# EAGLE design PushButton_RGB1 (EAGLE 9.6.2)

## Sheet 1 of 2
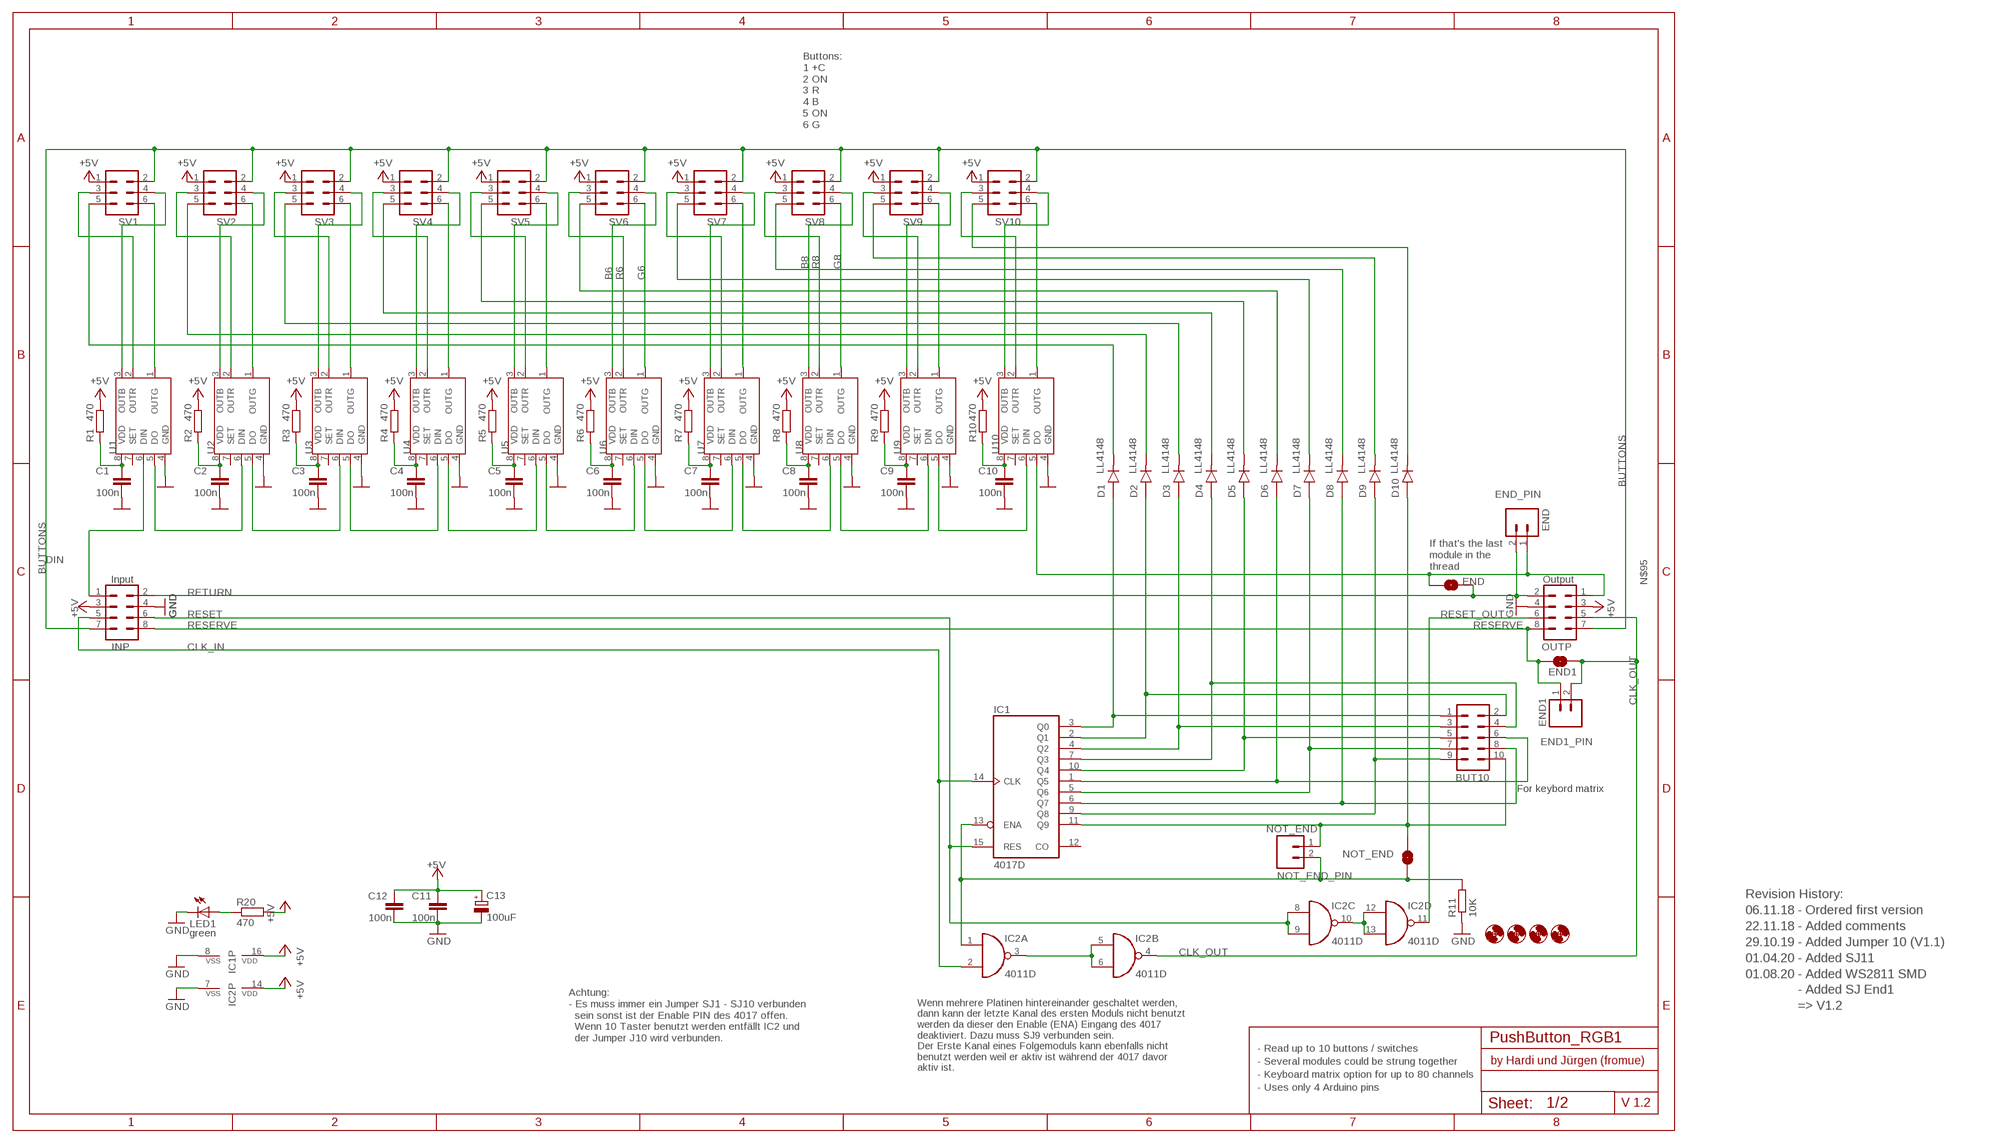
[diagram p0: schematic, sheet 1]

### Parts
BUT10  CON-HARTING-ML_ML10  [CON-HARTING-ML_ML10]
C1  100n  C-EUC0603  [C0603]
C2  100n  C-EUC0603  [C0603]
C3  100n  C-EUC0603  [C0603]
C4  100n  C-EUC0603  [C0603]
C5  100n  C-EUC0603  [C0603]
C6  100n  C-EUC0603  [C0603]
C7  100n  C-EUC0603  [C0603]
C8  100n  C-EUC0603  [C0603]
C9  100n  C-EUC0603  [C0603]
C10  100n  C-EUC0603  [C0603]
C11  100n  C-EUC0603  [C0603]
C12  100n  C-EUC0603  [C0603]
C13  100uF  CPOL-EUD/7343-31W  [D/7343-31W]
D1  LL4148  [DIO_LL4148]
D2  LL4148  [DIO_LL4148]
D3  LL4148  [DIO_LL4148]
D4  LL4148  [DIO_LL4148]
D5  LL4148  [DIO_LL4148]
D6  LL4148  [DIO_LL4148]
D7  LL4148  [DIO_LL4148]
D8  LL4148  [DIO_LL4148]
D9  LL4148  [DIO_LL4148]
D10  LL4148  [DIO_LL4148]
END  SOLDERJUMPERNO  [SJ_2S-NO]
END1  SOLDERJUMPERNO  [SJ_2S-NO]
END1_PIN  END1  M02PTH  [1X02]
END_PIN  END  M02PTH  [1X02]
H1  MOUNT-HOLE3.0  [3,0]
H2  MOUNT-HOLE3.0  [3,0]
H3  MOUNT-HOLE3.0  [3,0]
H4  MOUNT-HOLE2.8  [2,8]
IC1  4017D  [SO16]
IC2  4011D  [SO14]
INP  CON-HARTING-ML_ML08  [CON-HARTING-ML_ML08]
LED1  green  LED3MM  [LED3MM]
NOT_END  SOLDERJUMPERNO  [SJ_2S-NO]
NOT_END_PIN  NOT_END  M02PTH  [1X02]
OUTP  CON-HARTING-ML_ML08  [CON-HARTING-ML_ML08]
R1  470  R-EU_R0603  [R0603]
R2  470  R-EU_R0603  [R0603]
R3  470  R-EU_R0603  [R0603]
R4  470  R-EU_R0603  [R0603]
R5  470  R-EU_R0603  [R0603]
R6  470  R-EU_R0603  [R0603]
R7  470  R-EU_R0603  [R0603]
R8  470  R-EU_R0603  [R0603]
R9  470  R-EU_R0603  [R0603]
R10  470  R-EU_R0603  [R0603]
R11  10K  R-EU_R0603  [R0603]
R20  470  R-EU_R0603  [R0603]
SV1  CON-HARTING-ML_ML6  [CON-HARTING-ML_ML6]
SV2  CON-HARTING-ML_ML6  [CON-HARTING-ML_ML6]
SV3  CON-HARTING-ML_ML6  [CON-HARTING-ML_ML6]
SV4  CON-HARTING-ML_ML6  [CON-HARTING-ML_ML6]
SV5  CON-HARTING-ML_ML6  [CON-HARTING-ML_ML6]
SV6  CON-HARTING-ML_ML6  [CON-HARTING-ML_ML6]
SV7  CON-HARTING-ML_ML6  [CON-HARTING-ML_ML6]
SV8  CON-HARTING-ML_ML6  [CON-HARTING-ML_ML6]
SV9  CON-HARTING-ML_ML6  [CON-HARTING-ML_ML6]
SV10  CON-HARTING-ML_ML6  [CON-HARTING-ML_ML6]
U1  S3PO_MODUL_WS2811_SOUND_MP3-TF-16P_WS2811_AND_ATTINY_WS2811-ICSOP8  [SOP8]
U2  S3PO_MODUL_WS2811_SOUND_MP3-TF-16P_WS2811_AND_ATTINY_WS2811-ICSOP8  [SOP8]
U3  S3PO_MODUL_WS2811_SOUND_MP3-TF-16P_WS2811_AND_ATTINY_WS2811-ICSOP8  [SOP8]
U4  S3PO_MODUL_WS2811_SOUND_MP3-TF-16P_WS2811_AND_ATTINY_WS2811-ICSOP8  [SOP8]
U5  S3PO_MODUL_WS2811_SOUND_MP3-TF-16P_WS2811_AND_ATTINY_WS2811-ICSOP8  [SOP8]
U6  S3PO_MODUL_WS2811_SOUND_MP3-TF-16P_WS2811_AND_ATTINY_WS2811-ICSOP8  [SOP8]
U7  S3PO_MODUL_WS2811_SOUND_MP3-TF-16P_WS2811_AND_ATTINY_WS2811-ICSOP8  [SOP8]
U8  S3PO_MODUL_WS2811_SOUND_MP3-TF-16P_WS2811_AND_ATTINY_WS2811-ICSOP8  [SOP8]
U9  S3PO_MODUL_WS2811_SOUND_MP3-TF-16P_WS2811_AND_ATTINY_WS2811-ICSOP8  [SOP8]
U10  S3PO_MODUL_WS2811_SOUND_MP3-TF-16P_WS2811_AND_ATTINY_WS2811-ICSOP8  [SOP8]

### Nets
+5V: C11.1 C12.1 C13.+ IC1.16(VDD) IC2.14(P:VDD) INP.3 OUTP.3 R1.2 R2.2 R3.2 R4.2 R5.2 R6.2 R7.2 R8.2 R9.2 R10.2 R20.2 SV1.1 SV2.1 SV3.1 SV4.1 SV5.1 SV6.1 SV7.1 SV8.1 SV9.1 SV10.1 ; also sheet 2
B6: SV6.4 U6.3(OUTB)
B8: SV8.4 U8.3(OUTB)
BUTTONS: INP.7 OUTP.7 SV1.2 SV2.2 SV3.2 SV4.2 SV5.2 SV6.2 SV7.2 SV8.2 SV9.2 SV10.2 ; also sheet 2
CLK_IN: IC1.14(CLK) IC2.2(A:I1) INP.5
CLK_OUT: END1.1 END1_PIN.2 IC2.4(B:O) OUTP.5
DIN: INP.1 U1.6(DIN)
G6: SV6.6 U6.1(OUTG)
G8: SV8.6 U8.1(OUTG)
GND: C1.2 C2.2 C3.2 C4.2 C5.2 C6.2 C7.2 C8.2 C9.2 C10.2 C11.2 C12.2 C13.- IC1.8(VSS) IC2.7(P:VSS) INP.4 LED1.K(C) OUTP.4 R11.1 U1.4(GND) U2.4(GND) U3.4(GND) U4.4(GND) U5.4(GND) U6.4(GND) U7.4(GND) U8.4(GND) U9.4(GND) U10.4(GND)
N$1: IC2.3(A:O) IC2.5(B:I0) IC2.6(B:I1)
N$2: IC1.13(ENA) IC2.1(A:I0) NOT_END.1 NOT_END_PIN.2 R11.2
N$3: IC2.10(C:O) IC2.12(D:I0) IC2.13(D:I1)
N$5: BUT10.10 D10.A IC1.11(Q9) NOT_END.2 NOT_END_PIN.1
N$6: C3.1 R3.1 U3.8(VDD)
N$7: C6.1 R6.1 U6.8(VDD)
N$8: U3.5(DO) U4.6(DIN)
N$9: C4.1 R4.1 U4.8(VDD)
N$10: D9.C SV9.5
N$11: BUT10.2 D2.A IC1.2(Q1)
N$12: BUT10.3 D3.A IC1.4(Q2)
N$13: BUT10.4 D4.A IC1.7(Q3)
N$14: BUT10.5 D5.A IC1.10(Q4)
N$15: BUT10.6 D6.A IC1.1(Q5)
N$16: BUT10.7 D7.A IC1.5(Q6)
N$17: BUT10.8 D8.A IC1.6(Q7)
N$18: BUT10.9 D9.A IC1.9(Q8)
N$19: SV1.3 U1.2(OUTR)
N$20: U4.5(DO) U5.6(DIN)
N$21: LED1.A R20.1
N$22: U1.5(DO) U2.6(DIN)
N$23: C5.1 R5.1 U5.8(VDD)
N$25: D10.C SV10.5
N$26: SV1.4 U1.3(OUTB)
N$27: SV1.6 U1.1(OUTG)
N$35: BUT10.1 D1.A IC1.3(Q0)
N$46: SV2.4 U2.3(OUTB)
N$49: SV2.6 U2.1(OUTG)
N$51: SV2.3 U2.2(OUTR)
N$56: SV3.4 U3.3(OUTB)
N$57: SV3.6 U3.1(OUTG)
N$58: SV3.3 U3.2(OUTR)
N$76: C1.1 R1.1 U1.8(VDD)
N$77: C2.1 R2.1 U2.8(VDD)
N$78: U6.5(DO) U7.6(DIN)
N$81: U2.5(DO) U3.6(DIN)
N$82: U5.5(DO) U6.6(DIN)
N$83: C7.1 R7.1 U7.8(VDD)
N$85: U7.5(DO) U8.6(DIN)
N$86: C8.1 R8.1 U8.8(VDD)
N$87: SV4.4 U4.3(OUTB)
N$88: SV4.6 U4.1(OUTG)
N$89: U8.5(DO) U9.6(DIN)
N$90: C9.1 R9.1 U9.8(VDD)
N$91: SV4.3 U4.2(OUTR)
N$92: U9.5(DO) U10.6(DIN)
N$93: C10.1 R10.1 U10.8(VDD)
N$95: END.2 END_PIN.1 OUTP.1 U10.5(DO)
N$96: SV5.4 U5.3(OUTB)
N$97: SV5.6 U5.1(OUTG)
N$98: SV5.3 U5.2(OUTR)
N$104: SV7.4 U7.3(OUTB)
N$105: SV7.6 U7.1(OUTG)
N$106: SV7.3 U7.2(OUTR)
N$112: SV9.4 U9.3(OUTB)
N$113: SV9.6 U9.1(OUTG)
N$114: SV9.3 U9.2(OUTR)
N$116: SV10.4 U10.3(OUTB)
N$117: SV10.6 U10.1(OUTG)
N$118: SV10.3 U10.2(OUTR)
N$120: D1.C SV1.5
N$121: D2.C SV2.5
N$122: D3.C SV3.5
N$123: D4.C SV4.5
N$124: D5.C SV5.5
N$125: D6.C SV6.5
N$126: D7.C SV7.5
N$127: D8.C SV8.5
R6: SV6.3 U6.2(OUTR)
R8: SV8.3 U8.2(OUTR)
RESERVE: END1.2 END1_PIN.1 INP.8 OUTP.8
RESET: IC1.15(RES) IC2.8(C:I0) IC2.9(C:I1) INP.6
RESET_OUT: IC2.11(D:O) OUTP.6
RETURN: END.1 END_PIN.2 INP.2 OUTP.2
Unconnected: IC1.12(CO) U1.7(SET) U2.7(SET) U3.7(SET) U4.7(SET) U5.7(SET) U6.7(SET) U7.7(SET) U8.7(SET) U9.7(SET) U10.7(SET)

### Notes on the sheet
- Buttons:
  1 +C
  2 ON
  3 R
  4 B
  5 ON
  6 G
- If that's the last
  module in the
  thread
- Input | Output
- For keybord matrix
- Achtung:
  - Es muss immer ein Jumper SJ1 - SJ10 verbunden
    sein sonst ist der Enable PIN des 4017 offen.
    Wenn 10 Taster benutzt werden entfällt IC2 und 
    der Jumper J10 wird verbunden.
- Wenn mehrere Platinen hintereinander geschaltet werden,
  dann kann der letzte Kanal des ersten Moduls nicht benutzt
  werden da dieser den Enable (ENA) Eingang des 4017
  deaktiviert. Dazu muss SJ9 verbunden sein.
  Der Erste Kanal eines Folgemoduls kann ebenfalls nicht
  benutzt werden weil er aktiv ist während der 4017 davor
  aktiv ist.
- Revision History:
  06.11.18 - Ordered first version
  22.11.18 - Added comments
  29.10.19 - Added Jumper 10 (V1.1)
  01.04.20 - Added SJ11
  01.08.20 - Added WS2811 SMD
                 - Added SJ End1
                 => V1.2
- by Hardi und Jürgen (fromue)
- - Read up to 10 buttons / switches
  - Several modules could be strung together
  - Keyboard matrix option for up to 80 channels
  - Uses only 4 Arduino pins
- V 1.2

## Sheet 2 of 2
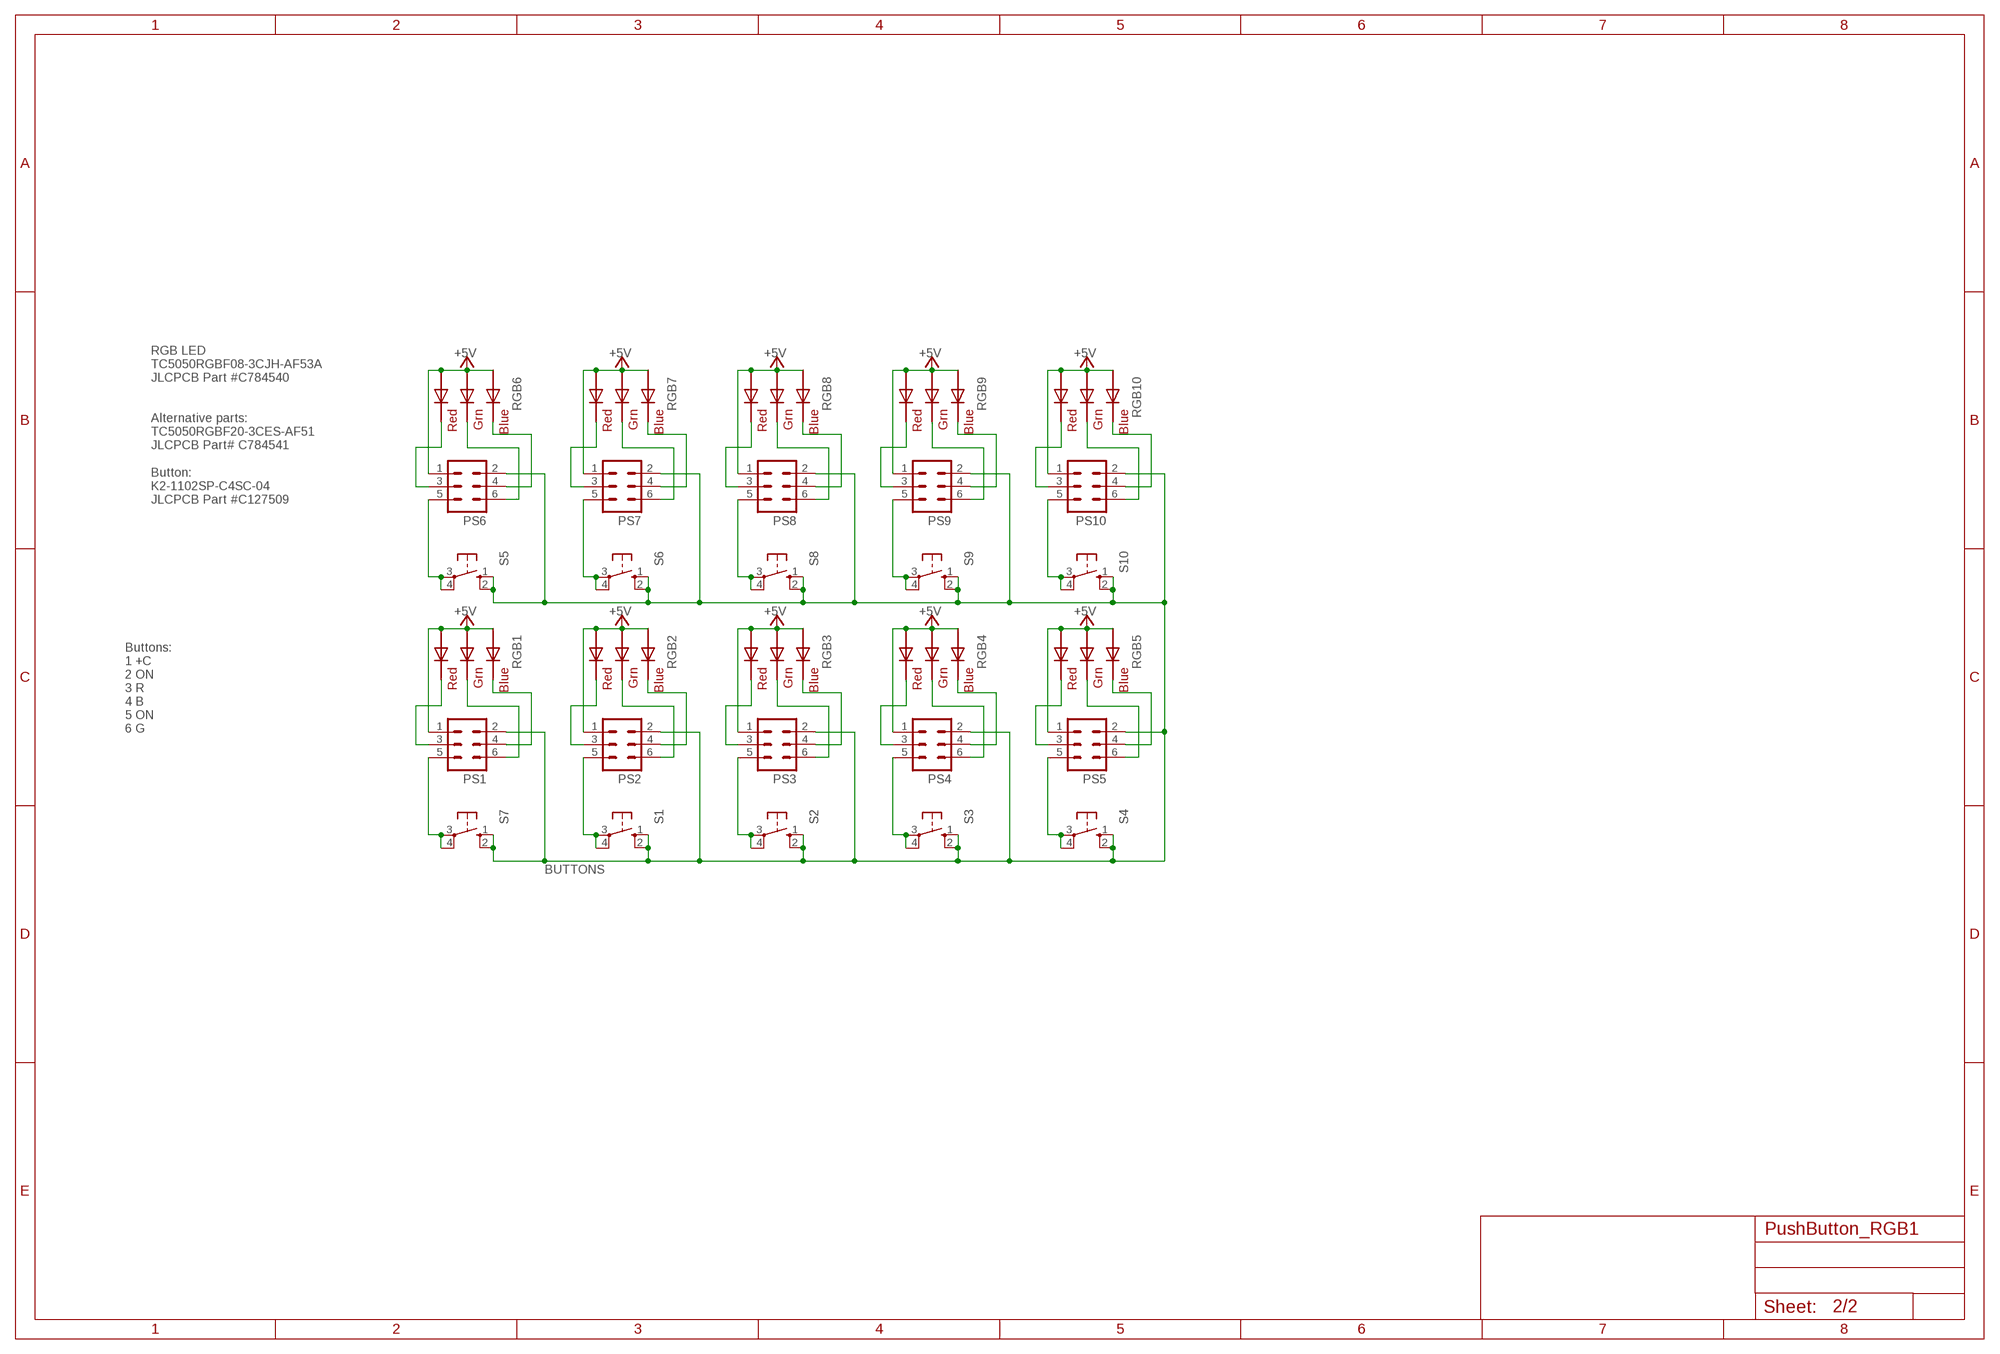
[diagram p1: schematic, sheet 2]

### Parts
PS1  CON-HARTING-ML_ML6BKL10120958  [BKL10120958_MIRROR]
PS2  CON-HARTING-ML_ML6BKL10120958  [BKL10120958_MIRROR]
PS3  CON-HARTING-ML_ML6BKL10120958  [BKL10120958_MIRROR]
PS4  CON-HARTING-ML_ML6BKL10120958  [BKL10120958_MIRROR]
PS5  CON-HARTING-ML_ML6BKL10120958  [BKL10120958_MIRROR]
PS6  CON-HARTING-ML_ML6BKL10120958  [BKL10120958_MIRROR]
PS7  CON-HARTING-ML_ML6BKL10120958  [BKL10120958_MIRROR]
PS8  CON-HARTING-ML_ML6BKL10120958  [BKL10120958_MIRROR]
PS9  CON-HARTING-ML_ML6BKL10120958  [BKL10120958_MIRROR]
PS10  CON-HARTING-ML_ML6BKL10120958  [BKL10120958_MIRROR]
RGB1  RGBLED5050  [RGBLED5050]
RGB2  RGBLED5050  [RGBLED5050]
RGB3  RGBLED5050  [RGBLED5050]
RGB4  RGBLED5050  [RGBLED5050]
RGB5  RGBLED5050  [RGBLED5050]
RGB6  RGBLED5050  [RGBLED5050]
RGB7  RGBLED5050  [RGBLED5050]
RGB8  RGBLED5050  [RGBLED5050]
RGB9  RGBLED5050  [RGBLED5050]
RGB10  RGBLED5050  [RGBLED5050]
S1  10-XXB3F-10XX_SMD  [B3F-10XX_SMD]
S2  10-XXB3F-10XX_SMD  [B3F-10XX_SMD]
S3  10-XXB3F-10XX_SMD  [B3F-10XX_SMD]
S4  10-XXB3F-10XX_SMD  [B3F-10XX_SMD]
S5  10-XXB3F-10XX_SMD  [B3F-10XX_SMD]
S6  10-XXB3F-10XX_SMD  [B3F-10XX_SMD]
S7  10-XXB3F-10XX_SMD  [B3F-10XX_SMD]
S8  10-XXB3F-10XX_SMD  [B3F-10XX_SMD]
S9  10-XXB3F-10XX_SMD  [B3F-10XX_SMD]
S10  10-XXB3F-10XX_SMD  [B3F-10XX_SMD]

### Nets
+5V: PS1.1 PS2.1 PS3.1 PS4.1 PS5.1 PS6.1 PS7.1 PS8.1 PS9.1 PS10.1 RGB1.1(GREEN_A) RGB1.2(RED_A) RGB1.3(BLUE_A) RGB2.1(GREEN_A) RGB2.2(RED_A) RGB2.3(BLUE_A) RGB3.1(GREEN_A) RGB3.2(RED_A) RGB3.3(BLUE_A) RGB4.1(GREEN_A) RGB4.2(RED_A) RGB4.3(BLUE_A) RGB5.1(GREEN_A) RGB5.2(RED_A) RGB5.3(BLUE_A) RGB6.1(GREEN_A) RGB6.2(RED_A) RGB6.3(BLUE_A) RGB7.1(GREEN_A) RGB7.2(RED_A) RGB7.3(BLUE_A) RGB8.1(GREEN_A) RGB8.2(RED_A) RGB8.3(BLUE_A) RGB9.1(GREEN_A) RGB9.2(RED_A) RGB9.3(BLUE_A) RGB10.1(GREEN_A) RGB10.2(RED_A) RGB10.3(BLUE_A) ; also sheet 1
B_6: PS6.4 RGB6.4(BLUE_C)
B_8: PS8.4 RGB8.4(BLUE_C)
BUTTONS: PS1.2 PS2.2 PS3.2 PS4.2 PS5.2 PS6.2 PS7.2 PS8.2 PS9.2 PS10.2 S1.1(S) S1.2(S1) S2.1(S) S2.2(S1) S3.1(S) S3.2(S1) S4.1(S) S4.2(S1) S5.1(S) S5.2(S1) S6.1(S) S6.2(S1) S7.1(S) S7.2(S1) S8.1(S) S8.2(S1) S9.1(S) S9.2(S1) S10.1(S) S10.2(S1) ; also sheet 1
G_6: PS6.6 RGB6.6(GREEN_C)
G_8: PS8.6 RGB8.6(GREEN_C)
N$4: PS1.6 RGB1.6(GREEN_C)
N$24: PS1.4 RGB1.4(BLUE_C)
N$28: PS1.3 RGB1.5(RED_C)
N$30: PS1.5 S7.3(P) S7.4(P1)
N$32: PS2.6 RGB2.6(GREEN_C)
N$33: PS2.4 RGB2.4(BLUE_C)
N$34: PS2.3 RGB2.5(RED_C)
N$37: PS2.5 S1.3(P) S1.4(P1)
N$39: PS3.6 RGB3.6(GREEN_C)
N$40: PS3.4 RGB3.4(BLUE_C)
N$41: PS3.3 RGB3.5(RED_C)
N$43: PS3.5 S2.3(P) S2.4(P1)
N$45: PS4.6 RGB4.6(GREEN_C)
N$47: PS4.4 RGB4.4(BLUE_C)
N$48: PS4.3 RGB4.5(RED_C)
N$52: PS4.5 S3.3(P) S3.4(P1)
N$54: PS5.6 RGB5.6(GREEN_C)
N$55: PS5.4 RGB5.4(BLUE_C)
N$59: PS5.3 RGB5.5(RED_C)
N$61: PS5.5 S4.3(P) S4.4(P1)
N$67: PS6.5 S5.3(P) S5.4(P1)
N$69: PS7.6 RGB7.6(GREEN_C)
N$70: PS7.4 RGB7.4(BLUE_C)
N$71: PS7.3 RGB7.5(RED_C)
N$73: PS7.5 S6.3(P) S6.4(P1)
N$94: PS8.5 S8.3(P) S8.4(P1)
N$103: PS9.6 RGB9.6(GREEN_C)
N$107: PS9.4 RGB9.4(BLUE_C)
N$111: PS9.3 RGB9.5(RED_C)
N$119: PS9.5 S9.3(P) S9.4(P1)
N$129: PS10.6 RGB10.6(GREEN_C)
N$130: PS10.4 RGB10.4(BLUE_C)
N$131: PS10.3 RGB10.5(RED_C)
N$133: PS10.5 S10.3(P) S10.4(P1)
R_6: PS6.3 RGB6.5(RED_C)
R_8: PS8.3 RGB8.5(RED_C)

### Notes on the sheet
- RGB LED
  TC5050RGBF08-3CJH-AF53A
  JLCPCB Part #C784540
  
  
  Alternative parts: 
  TC5050RGBF20-3CES-AF51
  JLCPCB Part# C784541
  
  Button:
  K2-1102SP-C4SC-04
  JLCPCB Part #C127509
- Buttons:
  1 +C
  2 ON
  3 R
  4 B
  5 ON
  6 G

## Library data of the parts
BUT10 = PushButtonAction_4017_2:CON-HARTING-ML_ML10: HARTING; OC_FARNELL: unknown; OC_NEWARK: unknown
C1-C12 = rcl:C-EU: CAPACITOR, European symbol; SPICEPREFIX: C
C13 = rcl:CPOL-EU: POLARIZED CAPACITOR, European symbol; SPICEPREFIX: C
D1-D10 = LL4148:LL4148: Surface Mount Switching Glass Check availability <https://pricing.snapeda.com/parts/LL4148/ON/view-part?ref=eda>; AVAILABILITY: In Stock; DESCRIPTION: Diode Standard 75V 300mA (DC) Surface Mount Mini MELF/DL-35; MF: ON; MP: LL4148; PACKAGE: SOD-80 Fairchild Semiconductor; PRICE: None
END END1 NOT_END = SparkFun-Retired:SOLDERJUMPER: Solder Jumper Standard SMD solder jumper. Used to automate production. Two varients : Normally Open and Normally Closed are the same, but have different paste layers. NC will have a large amount of paste and should jumper during reflow.
END1_PIN END_PIN NOT_END_PIN = SparkFun-Connectors:M02: Standard 2-pin 0.1" header. Use with - straight break away headers ( PRT-00116) - right angle break away headers (PRT-00553) - swiss pins (PRT-00743) - machine pins (PRT-00117) - female headers (PRT-00115) Molex polarized connector foot print use with: PRT-08233 with associated crimp pins and housings. 2.54_SCREWTERM for use with PRT-10571. 3.5mm Screw Terminal footprints for PRT-08084 5mm Screw Terminal footprints for use with PRT-08432
H1-H4 = holes:MOUNT-HOLE: MOUNTING HOLE with drill center marker
IC1 = 40xx:4017: COUNTER/DIVIDER
IC2 = 40xx:4011: Quad 2-input NAND; SPICEPREFIX: J
INP OUTP = PushButtonAction_4017_2:CON-HARTING-ML_ML08: Modified by Hardi; OC_FARNELL: unknown; OC_NEWARK: unknown
LED1 = led:LED: LED OSRAM: - CHIPLED LG R971, LG N971, LY N971, LG Q971, LY Q971, LO R971, LY R971 LH N974, LH R974 LS Q976, LO Q976, LY Q976 LO Q996 - Hyper CHIPLED LW Q18S LB Q993, LB Q99A, LB R99A - SideLED LS A670, LO A670, LY A670, LG A670, LP A670 LB A673, LV A673, LT A673, LW A673 LH A674 LY A675 LS A676, LA A676, LO A676, LY A676, LW A676 LS A679, LY A679, LG A679 - Hyper Micro SIDELED® LS Y876, LA Y876, LO Y876, LY Y876 LT Y87S - SmartLED LW L88C, LW L88S LB L89C, LB L89S, LG L890 LS L89K, LO L89K, LY L89K LS L896, LA L896, LO L896, LY L896 - TOPLED LS T670, LO T670, LY T670, LG T670, LP T670 LSG T670, LSP T670, LSY T670, LOP T670, LYG T670 LG T671, LOG T671, LSG T671 LB T673, LV T673, LT T673, LW T673 LH T674 LS T676, LA T676, LO T676, LY T676, LB T676, LH T676, LSB T676, LW T676 LB T67C, LV T67C, LT T67C, LS T67K, LO T67K, LY T67K, LW E67C LS E67B, LA E67B, LO E67B, LY E67B, LB E67C, LV E67C, LT E67C LW T67C LS T679, LY T679, LG T679 LS T770, LO T770, LY T770, LG T770, LP T770 LB T773, LV T773, LT T773, LW T773 LH T774 LS E675, LA E675, LY E675, LS T675 LS T776, LA T776, LO T776, LY T776, LB T776 LHGB T686 LT T68C, LB T68C - Hyper Mini TOPLED® LB M676 - Mini TOPLED Santana® LG M470 LS M47K, LO M47K, LY M47K Source: http://www.osram.convergy.de LUXEON: - LUMILED® LXK2-PW12-R00, LXK2-PW12-S00, LXK2-PW14-U00, LXK2-PW14-V00 LXK2-PM12-R00, LXK2-PM12-S00, LXK2-PM14-U00 LXK2-PE12-Q00, LXK2-PE12-R00, LXK2-PE12-S00, LXK2-PE14-T00, LXK2-PE14-U00 LXK2-PB12-K00, LXK2-PB12-L00, LXK2-PB12-M00, LXK2-PB14-N00, LXK2-PB14-P00, LXK2-PB14-Q00 LXK2-PR12-L00, LXK2-PR12-M00, LXK2-PR14-Q00, LXK2-PR14-R00 LXK2-PD12-Q00, LXK2-PD12-R00, LXK2-PD12-S00 LXK2-PH12-R00, LXK2-PH12-S00 LXK2-PL12-P00, LXK2-PL12-Q00, LXK2-PL12-R00 Source: www.luxeon.com KINGBRIGHT: KA-3528ASYC Source: www.kingbright.com
PS1-PS10 = PushButtonAction_4017_4:CON-HARTING-ML_ML6: HARTING
R1-R11 R20 = rcl:R-EU_: RESISTOR, European symbol; SPICEPREFIX: R
RGB1-RGB10 = adafruit:RGBLED: For 5050 RGB LEDs, the order of the LEDs may vary from one manufacturer to another!
S1-S10 = switch-omron:10-XX: OMRON SWITCH
SV1-SV10 = PushButtonAction_4017_4:CON-HARTING-ML_ML6: HARTING; OC_FARNELL: unknown; OC_NEWARK: unknown
U1-U10 = S3PO_Modul_WS2811:S3PO_MODUL_WS2811_SOUND_MP3-TF-16P_WS2811_AND_ATTINY_WS2811-IC: Die Pin Nummern für R und G sind getauscht damit sie gleich angesteuert werden wie die WS2812. Der Daten Strom der WS2811 ist RGB, Beim WS2812 ist es aber GRB.

## Board
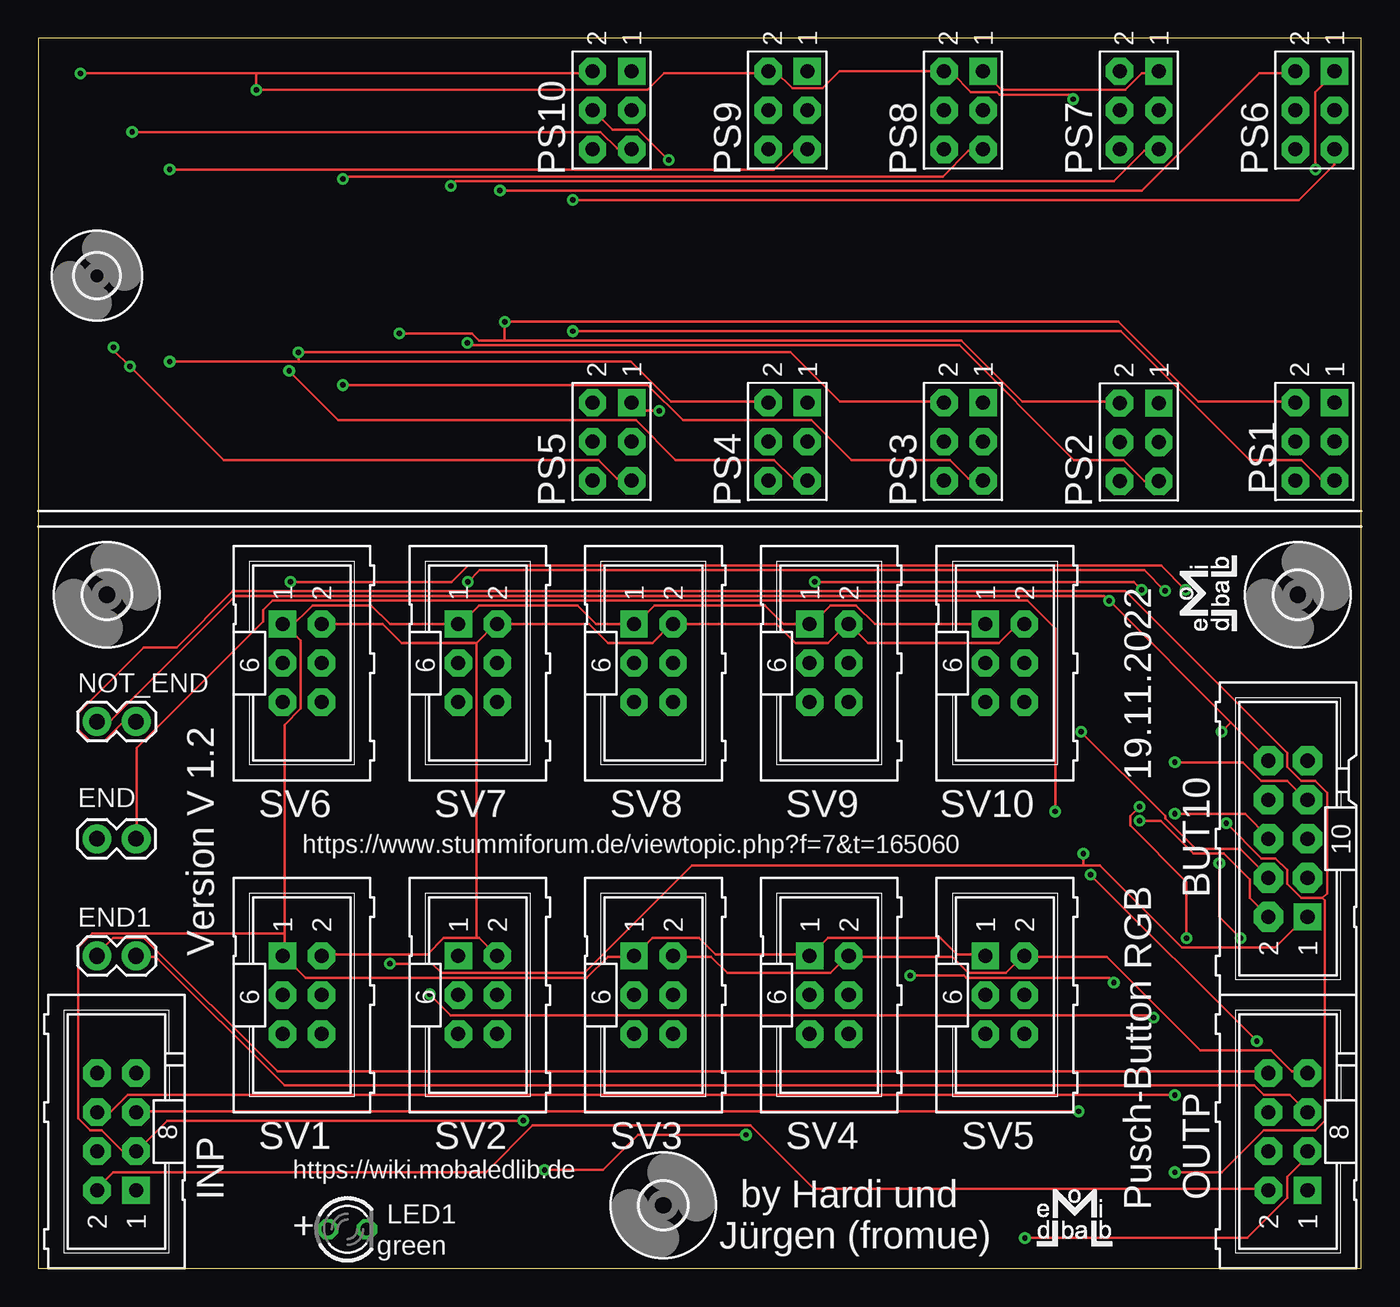
[diagram p2: board, top side]
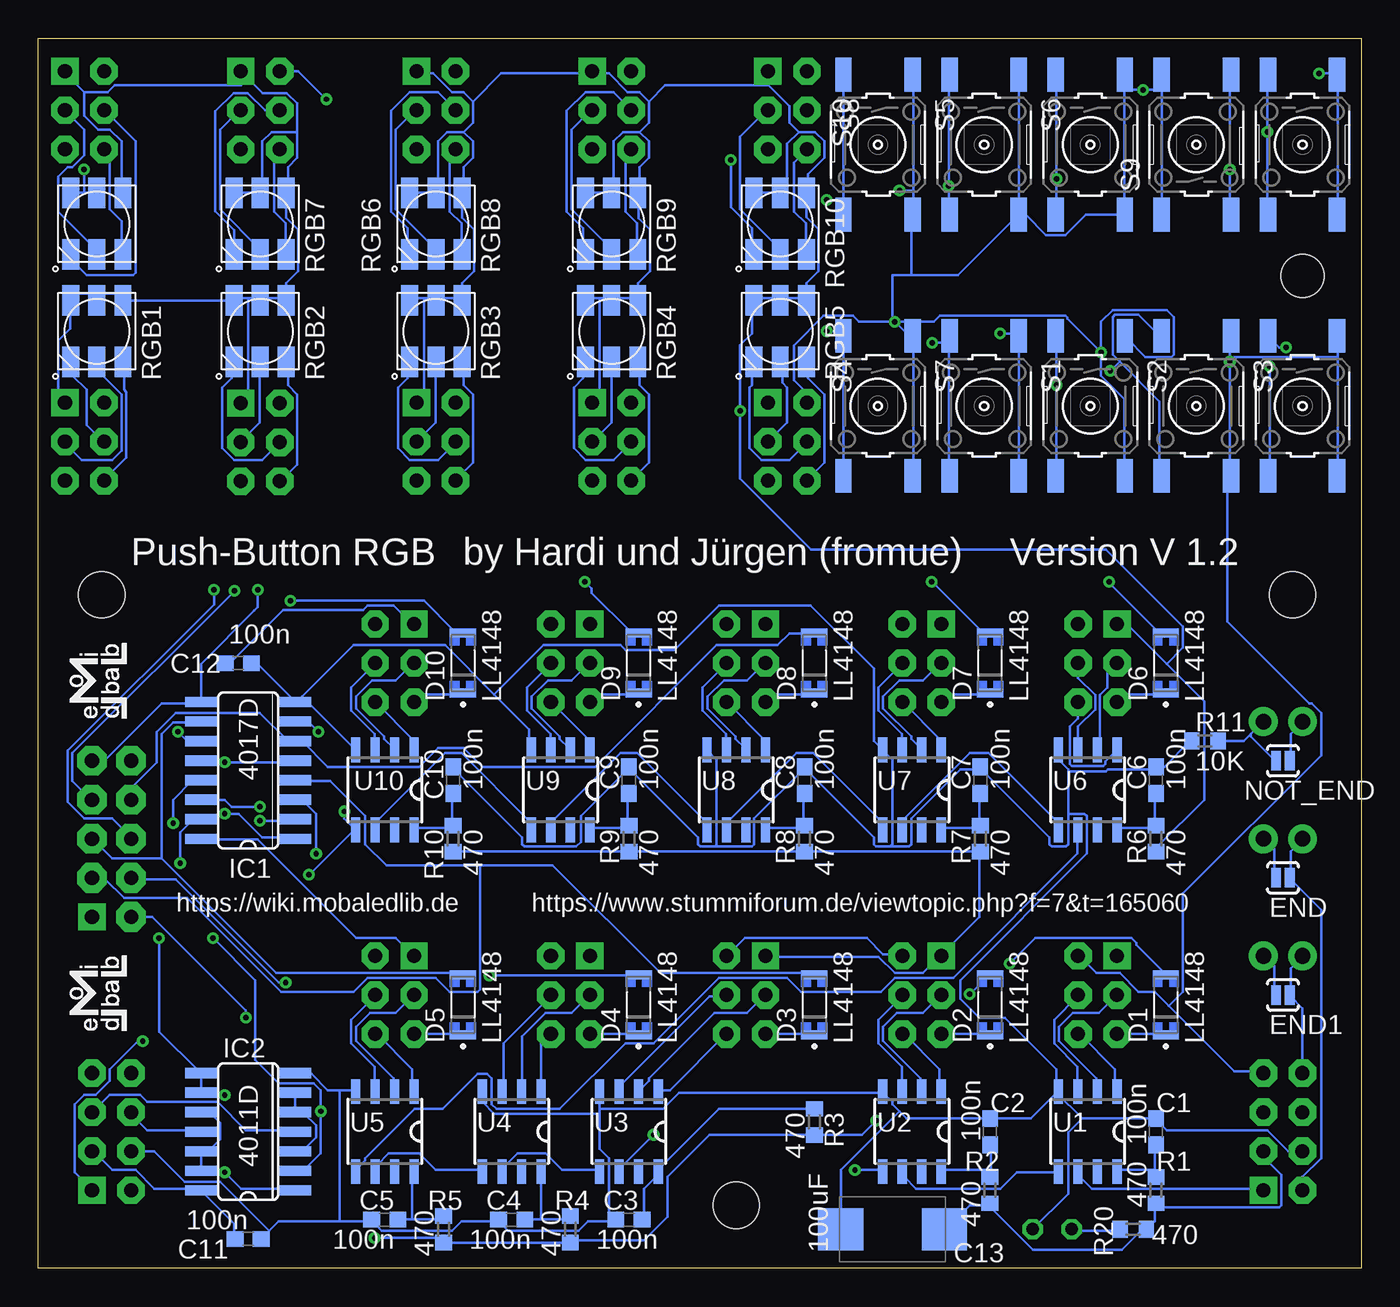
[diagram p3: board, bottom side, seen from below]

Size 86.03 x 80 mm. Coordinates in mm from the lower left corner, seen from the top.
Outline: 0,0 86.03,0 86.03,80 0,80 0,0
Copper layers (1*16): Top 0.035mm / dielectric 1.5mm / Bottom 0.035mm
Design rules "default *": minimum track width 6mil, minimum drill 0.35mm, track to track 6mil, track to pad 6mil, pad to pad 6mil, via to via 6mil, smd to smd 6mil, copper to edge 40mil, drill to drill 6mil, minimum pad ring 10mil, minimum via ring 8mil, stop-mask expansion 4mil, vias tented up to drill 0.5mm, thermal gap 10mil

### Footprints (pad centres in the part's own frame; a part is rotated, then mirrored left to right if it is on the bottom)
CON-HARTING-ML_ML10 = drill 0.914 pad 1.778 square: 1 -5.08,-1.27 | drill 0.914 pad 1.93 octagon: 2 -5.08,1.27; 3 -2.54,-1.27; 4 -2.54,1.27; 5 0,-1.27; 6 0,1.27; 7 2.54,-1.27; 8 2.54,1.27; 9 5.08,-1.27; 10 5.08,1.27
C0603 = smd 1.1 x 1: 1 -0.85,0; 2 0.85,0
D/7343-31W = smd 2.95 x 2.7: + 3.375,0; - -3.375,0
DIO_LL4148 = smd 0.6 x 1.65: A 1.95,0; C -1.95,0
SJ_2S-NO = smd 0.635 x 1.27: 1 -0.45,0; 2 0.45,0
1X02 = drill 1.016 pad 1.88: 1 0,0; 2 2.54,0
3,0 = hole 3: 0,0
2,8 = hole 2.8: 0,0
SO16 = smd 0.66 x 2.032: 1 -4.445,-3.073; 2 -3.175,-3.073; 3 -1.905,-3.073; 4 -0.635,-3.073; 5 0.635,-3.073; 6 1.905,-3.073; 7 3.175,-3.073; 8 4.445,-3.073; 9 4.445,3.073; 10 3.175,3.073; 11 1.905,3.073; 12 0.635,3.073; 13 -0.635,3.073; 14 -1.905,3.073; 15 -3.175,3.073; 16 -4.445,3.073
SO14 = smd 0.66 x 2.032: 1 -3.81,-3.073; 2 -2.54,-3.073; 3 -1.27,-3.073; 4 0,-3.073; 5 1.27,-3.073; 6 2.54,-3.073; 7 3.81,-3.073; 8 3.81,3.073; 9 2.54,3.073; 10 1.27,3.073; 11 0,3.073; 12 -1.27,3.073; 13 -2.54,3.073; 14 -3.81,3.073
CON-HARTING-ML_ML08 = drill 0.914 pad 1.778 square: 1 -5.08,-1.27 | drill 0.914 pad 1.778 octagon: 2 -5.08,1.27; 3 -2.54,-1.27; 4 -2.54,1.27; 5 0,-1.27; 6 0,1.27; 7 2.54,-1.27; 8 2.54,1.27
LED3MM = drill 0.813 octagon: A -1.27,0; K 1.27,0
BKL10120958_MIRROR = drill 0.914 pad 1.778 square: 1 -2.54,1.27 | drill 0.914 pad 1.778 octagon: 2 -2.54,-1.27; 3 0,1.27; 4 0,-1.27; 5 2.54,1.27; 6 2.54,-1.27
R0603 = smd 1 x 1.1: 1 -0.85,0; 2 0.85,0
RGBLED5050 = smd 2 x 1.1: 1 -2,1.7; 2 -2,0; 3 -2,-1.7; 4 2,-1.7; 5 2,0; 6 2,1.7
B3F-10XX_SMD = smd 2.184 x 1.067: 1 -4.55,2.25; 2 4.55,2.25; 3 -4.55,-2.25; 4 4.55,-2.25
CON-HARTING-ML_ML6 = drill 0.914 pad 1.778 square: 1 -2.54,-1.27 | drill 0.914 pad 1.778 octagon: 2 -2.54,1.27; 3 0,-1.27; 4 0,1.27; 5 2.54,-1.27; 6 2.54,1.27
SOP8 = smd 0.6 x 1.6: 1 -1.905,-2.6; 2 -0.635,-2.6; 3 0.635,-2.6; 4 1.905,-2.6; 5 1.905,2.6; 6 0.635,2.6; 7 -0.635,2.6; 8 -1.905,2.6

### Placement (x,y rotation side)
BUT10  81.28,27.94 90 top
C1  13.34,8.89 90 bottom
C2  24.13,8.89 90 bottom
C3  47.62,3.17 180 bottom
C4  55.24,3.17 180 bottom
C5  63.5,3.17 180 bottom
C6  13.34,31.75 90 bottom
C7  24.77,31.75 90 bottom
C8  36.2,31.75 90 bottom
C9  47.62,31.75 90 bottom
C10  59.05,31.75 90 bottom
C11  72.39,1.91 0 bottom
C12  73.03,39.37 0 bottom
C13  30.48,2.54 0 bottom
D1  12.7,17.14 90 bottom
D2  24.13,17.14 90 bottom
D3  35.56,17.14 90 bottom
D4  46.99,17.14 90 bottom
D5  58.42,17.14 90 bottom
D6  12.7,39.37 90 bottom
D7  24.13,39.37 90 bottom
D8  35.56,39.37 90 bottom
D9  46.99,39.37 90 bottom
D10  58.42,39.37 90 bottom
END  5.08,25.4 180 bottom
END1  5.08,17.78 0 bottom
END1_PIN  3.81,20.32 0 top
END_PIN  6.35,27.94 180 top
H1  40.64,4.1 0 top
H2  4.45,43.81 0 top
H3  81.92,43.81 0 top
H4  3.81,64.57 0 top
IC1  72.39,32.38 90 bottom
IC2  72.39,8.89 90 bottom
INP  5.08,10.16 90 top
LED1  20.1,2.54 0 top
NOT_END  5.08,33.02 0 bottom
NOT_END_PIN  3.81,35.56 0 top
OUTP  81.28,10.16 90 top
PS1  83.03,53.77 270 top
PS2  71.6,53.74 270 top
PS3  60.17,53.77 270 top
PS4  48.74,53.77 270 top
PS5  37.31,53.77 270 top
PS6  83.03,75.33 270 top
PS7  71.6,75.33 270 top
PS8  60.17,75.33 270 top
PS9  48.74,75.33 270 top
PS10  37.31,75.33 270 top
R1  13.34,5.08 270 bottom
R2  24.13,5.08 270 bottom
R3  35.56,9.53 270 bottom
R4  51.44,2.54 270 bottom
R5  59.69,2.54 270 bottom
R6  13.34,27.94 270 bottom
R7  24.77,27.94 270 bottom
R8  36.2,27.94 270 bottom
R9  47.62,27.94 270 bottom
R10  59.05,27.94 270 bottom
R11  10.16,34.29 0 bottom
R20  14.82,2.54 0 bottom
RGB1  82.23,60.96 270 bottom
RGB2  71.6,60.96 270 bottom
RGB3  60.17,60.96 270 bottom
RGB4  48.74,60.96 270 bottom
RGB5  37.78,60.96 270 bottom
RGB6  82.23,67.94 270 bottom
RGB7  71.6,67.94 270 bottom
RGB8  60.17,67.94 270 bottom
RGB9  48.74,67.94 270 bottom
RGB10  37.78,67.94 270 bottom
S1  24.52,56.09 270 bottom
S2  17.61,56.09 270 bottom
S3  10.71,56.09 270 bottom
S4  3.81,56.09 270 bottom
S5  31.42,73.09 270 bottom
S6  24.52,73.09 270 bottom
S7  31.42,56.09 270 bottom
S8  17.61,73.09 270 bottom
S9  10.71,73.09 90 bottom
S10  3.81,73.09 270 bottom
SV1  17.14,17.78 270 top
SV2  28.57,17.78 270 top
SV3  40.01,17.78 270 top
SV4  51.44,17.78 270 top
SV5  62.87,17.78 270 top
SV6  17.14,39.37 270 top
SV7  28.57,39.37 270 top
SV8  40.01,39.37 270 top
SV9  51.44,39.37 270 top
SV10  62.87,39.37 270 top
U1  17.78,8.89 180 bottom
U2  29.21,8.89 180 bottom
U3  47.62,8.89 180 bottom
U4  55.24,8.89 180 bottom
U5  63.5,8.89 180 bottom
U6  17.78,31.11 180 bottom
U7  29.21,31.11 180 bottom
U8  40.64,31.11 180 bottom
U9  52.07,31.11 180 bottom
U10  63.5,31.11 180 bottom

### Tracks (layer width: path | path; a pad name or v marks a point on that pad's centre or on a via)
+5V  (via drill 0.35)
  Top 0.152: SV5.1 61.57,20.42 59.74,20.42 58.67,21.49 51.36,21.49 50.29,20.42 SV4.1 50.14,20.42 44.04,20.42 42.98,21.49 39.93,21.49 38.86,20.42 SV3.1 38.71,20.27 37.03,20.27 35.66,18.9 17.37,18.9 16,20.27 SV1.1 16,20.42 16,21.79 | v64.16,1.98 78.64,1.98 81.23,4.57 81.23,5.94 82.45,7.16 82.45,7.62 OUTP.3 | 16,21.79 16,35.36 17.07,36.42 17.07,40.84 16.31,41.6 | 16.31,41.6 16,41.91 SV6.1 16.31,41.6 | 16.31,41.6 17.83,43.13 21.64,43.13 22.86,41.91 SV7.1 27.43,41.91 28.65,43.13 35.05,43.13 36.27,41.91 SV8.1 38.86,41.91 40.08,43.13 47.24,43.13 48.46,41.91 SV9.1 50.29,41.91 51.51,43.13 53.19,43.13 54.41,41.91 SV10.1 | 16,21.79 3.5,21.79 2.59,20.88 2.59,9.75 3.35,8.99 4.12,8.99 5.49,7.62 INP.3 6.4,7.62 8.38,9.6 v31.55,9.6 | v83.06,71.48 83.06,76.5 84.28,77.72 PS6.1 | v40.39,55.78 39.17,55.78 38.71,56.24 PS5.1 | PS7.1 72.85,77.72 71.78,77.72 70.71,76.66 62.64,76.66 61.57,77.72 PS8.1
  Bottom 0.152: IC1.16 75.44,27.89 71.78,27.89 65.38,21.49 62.79,21.49 61.72,20.42 SV5.1 | R10.2 58.98,27.13 47.7,27.13 R9.2 47.55,27.13 36.27,27.13 R8.2 36.12,27.13 24.84,27.13 R7.2 24.84,26.98 24.84,22.86 27.28,20.42 SV2.1 27.43,20.27 28.5,19.2 30.33,19.2 31.39,20.27 38.71,20.27 SV3.1 | C11.1 73.3,1.98 73.3,2.9 75.44,5.03 IC2.14 75.59,5.18 78.49,5.18 79.7,6.4 81.23,6.4 82.45,7.62 OUTP.3 | v64.16,1.98 59.89,1.98 59.74,1.83 R5.2 59.59,1.68 51.51,1.68 R4.2 51.36,1.83 46.63,1.83 45.11,3.35 45.11,5.94 42.37,8.69 35.66,8.69 R3.2 35.51,8.69 32.46,8.69 v31.55,9.6 | 13.41,3.96 13.41,3.05 13.87,2.59 R20.2 14.02,2.44 14.33,2.44 15.54,1.22 21.34,1.22 24.23,4.12 | 13.41,3.96 13.41,4.12 R1.2 13.41,3.96 | 24.23,4.12 25.45,4.12 26.98,2.59 C13.+ | 24.23,4.12 R2.2 | 13.41,3.96 5.33,3.96 5.18,4.12 5.18,6.1 6.25,7.16 6.25,7.62 INP.3 | C12.1 73.76,39.47 73.46,39.47 70.1,42.82 64.92,42.82 64.62,43.13 62.94,43.13 61.72,41.91 SV10.1 | 12.65,39.32 15.24,41.91 SV6.1 | 12.65,39.32 10.21,36.88 10.21,30.48 13.26,27.43 13.26,27.13 R6.2 | 83.06,69.95 83.82,69.95 RGB6.3 | 83.06,69.95 82.3,69.95 RGB6.2 | 83.06,76.5 83.06,74.98 82.14,74.07 81.38,74.07 80.62,73.3 80.62,69.95 RGB6.1 | 83.06,76.5 84.28,77.72 PS6.1 | v83.06,71.48 83.06,69.95 | RGB7.3 73.3,69.95 71.63,69.95 RGB7.2 71.48,69.95 71.48,73.3 70.87,73.91 69.28,73.91 69.22,73.98 | 58.37,73.91 57.76,73.3 57.76,72.24 58.37,71.63 58.37,69.95 RGB8.1 58.47,68.35 57.7,67.58 57.7,64.85 58.47,64.07 RGB3.1 | 58.37,73.91 59.44,73.91 60.05,73.3 60.05,69.95 RGB8.2 60.2,69.95 61.87,69.95 RGB8.3 | 57.76,75.89 58.37,76.5 59.13,76.5 60.35,77.72 61.42,77.72 PS8.1
  Bottom 0.152: 57.76,75.89 57.76,74.52 58.37,73.91 | 46.94,73.91 46.33,73.3 46.33,72.24 46.94,71.63 46.94,69.95 47,69.95 | 46.94,73.91 48.01,73.91 48.62,73.3 48.62,69.95 RGB9.2 48.77,69.95 50.44,69.95 RGB9.3 | 47,69.95 RGB9.1 | 46.33,75.89 46.94,76.5 47.7,76.5 48.92,77.72 49.99,77.72 PS9.1 50.14,77.72 55.93,77.72 57.76,75.89 | 46.33,75.89 46.33,74.52 46.94,73.91 | 36.58,73.91 35.51,73.91 34.9,73.3 34.9,72.24 35.97,71.17 35.97,69.95 RGB10.1 36.08,68.36 35.3,67.59 35.3,64.85 36.08,64.07 RGB5.1 36.12,63.09 37.64,63.09 RGB5.2 37.8,63.09 39.47,63.09 RGB5.3 | 36.58,73.91 37.34,73.15 37.34,70.26 37.64,69.95 RGB10.2 37.8,69.95 39.47,69.95 RGB10.3 | 38.56,76.96 38.56,77.72 PS10.1 | 38.56,76.96 37.19,75.59 37.19,74.52 36.58,73.91 | RGB1.1 80.62,63.4 82.14,63.4 RGB1.2 82.3,63.4 83.82,63.4 RGB1.3 83.97,63.25 83.97,61.11 84.73,60.35 84.73,56.69 84.43,56.39 PS1.1 | RGB2.1 69.95,63.09 71.48,63.09 RGB2.2 71.63,63.09 72.39,63.09 | 72.39,63.09 73.3,63.09 RGB2.3 | 72.39,63.09 72.39,56.84 72.85,56.39 PS2.1 | RGB3.1 58.52,63.09 60.05,63.09 RGB3.2 60.2,63.09 60.96,63.09 | 60.96,63.09 61.87,63.09 RGB3.3 62.03,63.09 | 60.96,63.09 60.96,56.84 61.42,56.39 PS3.1 | RGB4.1 47.09,63.09 48.62,63.09 RGB4.2 48.77,63.09 49.53,63.09 | 49.53,63.09 50.44,63.09 RGB4.3 50.6,63.09 | 49.53,63.09 49.53,56.84 49.99,56.39 PS4.1 | RGB5.3 39.62,62.94 39.62,60.81 40.39,60.05 v40.39,55.78 40.39,51.36 35.79,46.76 16.59,46.76 11.58,41.76 11.58,40.39 12.65,39.32 | 80.31,63.09 80.47,63.25 RGB1.1 | 73.46,63.09 RGB2.3 | 39.62,63.09 RGB5.3 | 46.94,63.09 RGB4.1 | 58.37,63.09 RGB3.1 | 69.8,63.09 RGB2.1 | 83.06,76.5 81.53,76.5 81.08,76.96 72.85,76.96 72.85,77.72 PS7.1 71.45,76.44 69.87,76.44 69.22,75.79 69.22,75.57 69.22,75.56 69.22,73.98
  Bottom 0.152: 38.56,76.96 45.26,76.96 46.33,75.89 | RGB4.1 47.04,64.07 46.27,64.85 46.27,67.58 47,68.31 47,69.95 | 69.22,73.98 69.22,73.33 69.19,73.3 69.19,72.24 69.8,71.63 69.8,69.95 RGB7.1 69.9,68.35 69.13,67.58 69.13,64.85 69.9,64.07 RGB2.1 | RGB1.1 RGB2.3
B6
  Bottom 0.152: U6.3 18.41,35.25 17.3,36.37 17.3,37.29 18.41,38.41 SV6.4
B8
  Bottom 0.152: U8.3 41.3,33.83 41.3,34.75 42.82,36.27 42.82,37.8 41.3,39.32 SV8.4
B_6
  Bottom 0.152: RGB6.4 83.82,65.84 83.82,65.53 82.91,64.62 81.28,64.62 79.86,64.62 79.7,64.77 79.7,73.3 81.69,75.29 PS6.4
B_8
  Bottom 0.152: RGB8.4 62.03,65.99 62.03,67.67 63.09,68.73 63.09,75.29 61.87,76.5 60.05,76.5 58.98,75.44 PS8.4
BUTTONS  (via drill 0.35)
  Top 0.152: SV6.2 22.4,41.91 23.62,40.69 28.5,40.69 | 28.5,40.69 29.72,41.91 SV7.2 35.81,41.91 37.03,40.69 39.93,40.69 41.15,41.91 SV8.2 48.01,41.91 49.23,40.69 51.36,40.69 52.58,41.91 SV9.2 52.73,41.91 53.95,40.69 62.48,40.69 63.7,41.91 SV10.2 | OUTP.7 82.45,12.8 81.53,12.8 80.16,14.17 75.59,14.17 69.49,20.27 64.16,20.27 SV5.2 64.01,20.27 62.94,19.2 60.5,19.2 59.44,20.27 52.73,20.27 SV4.2 52.58,20.27 51.51,19.2 44.81,19.2 43.74,20.27 41.3,20.27 SV3.2 | 28.5,21.49 28.65,21.49 29.72,20.42 SV2.2 | 28.5,21.49 26.36,21.49 25.3,20.42 18.44,20.42 SV1.2 | 28.5,21.49 28.5,40.69 | v30.02,70.1 71.78,70.1 79.4,77.72 81.69,77.72 PS6.2 | v2.74,77.72 14.17,77.72 | 14.17,77.72 35.97,77.72 PS10.2 | 30.33,60.35 28.65,60.35 28.19,60.81 v23.47,60.81 | 30.33,60.35 60.05,60.35 64.01,56.39 70.26,56.39 PS2.2 | PS3.2 58.83,56.39 52.12,56.39 48.92,59.59 v16.92,59.59 16.92,58.98 | v8.53,58.98 16.92,58.98 | 16.92,58.98 38.56,58.98 41.15,56.39 47.4,56.39 PS4.2 | PS1.2 81.69,56.39 75.44,56.39 70.26,61.57 v30.33,61.57 30.33,60.35 | 14.17,77.72 v14.17,76.66 39.62,76.66 40.69,77.72 47.4,77.72 PS9.2 47.91,77.87 49.03,76.75 51,76.75 52.12,77.87 PS8.2 58.98,77.72 59.44,77.72 60.66,76.5 62.36,76.5 62.51,76.35 67.01,76.35 v67.31,76.05
  Bottom 0.152: 12.5,17.07 13.41,17.98 14.48,17.98 15.7,19.2 17.22,19.2 18.29,20.27 SV1.2 | 12.5,17.07 8.23,12.8 6.4,12.8 INP.7 | SV2.2 29.87,20.42 31.09,20.42 32.16,21.49 40.08,21.49 41.15,20.42 SV3.2 | S6.2 22.25,68.58 22.25,77.57 S6.1 | 29.26,64.62 26.21,64.62 22.4,68.43 S6.2 | 29.26,64.62 30.48,64.62 30.48,61.72 v30.33,61.57 | 15.39,76.66 15.39,77.57 S8.1 15.39,76.66 | 15.39,76.66 15.39,68.58 S8.2 17.92,68.54 19.24,67.22 20.49,67.22 21.81,68.54 S6.2 | 12.95,76.66 12.95,77.57 S9.2 12.95,76.66 | 12.95,76.66 12.95,68.58 S9.1 | 12.95,76.66 v14.17,76.66 15.39,76.66 | 29.11,70.1 29.11,77.57 S5.1 | 29.11,70.1 29.11,68.58 S5.2 29.26,68.43 29.26,64.62 | 29.11,70.1 v30.02,70.1 | S10.2 1.52,68.58 1.52,77.57 S10.1 1.68,77.72 v2.74,77.72 | S1.2 22.25,51.66 22.25,60.5 S1.1 22.4,60.66 22.55,60.81 v23.47,60.81 | v16.92,59.59 16.92,61.57 16.15,62.33 12.65,62.33 12.19,61.87 12.19,59.44 12.34,59.28 14.02,59.28 15.24,60.5 S2.1 | v16.92,59.59 16.92,58.06 15.39,56.54 15.39,51.66 S2.2 | v8.53,58.98 8.53,51.66 S3.2 8.69,51.32 8.69,42.06 3.35,36.73 3.2,36.73 2.59,36.12 2.59,33.38 11.58,24.38 11.58,17.98 12.5,17.07 | S7.2 29.11,51.66 29.11,60.5 S7.1 29.26,60.5 v30.33,61.57 | 1.52,59.28 1.52,60.5 S4.1 | 1.52,59.28 1.52,51.66 S4.2 | 1.52,59.28 8.23,59.28 v8.53,58.98 | PS5.2 36.12,56.39 36.12,57 36.88,57.76 36.88,60.03 34.95,61.96 33.04,61.96 32.65,61.57 v30.33,61.57 | v30.33,61.57 27.79,61.57 27.39,61.96 19.24,61.96 19.1,61.83 19.1,61.77 v16.92,59.59 | v67.31,76.05 69.13,77.87 PS7.2 | v8.53,58.98 8.53,60.57 S3.1
CLK_IN  (via drill 0.35)
  Top 0.152: v74.68,21.49 74.68,25.15 71.02,28.8 71.02,29.41 v71.63,30.02 | v67.67,10.21 6.4,10.21 INP.5
  Bottom 0.152: v74.68,21.49 71.93,18.75 71.93,13.56 70.41,12.04 68.12,12.04 67.67,11.58 v67.67,10.21 67.67,7.47 68.73,6.4 69.19,6.4 IC2.2 | v71.63,30.02 73.46,30.02 73.91,30.48 IC1.14
CLK_OUT
  Top 0.152: END1_PIN.2 6.4,20.27 7.62,20.27 16,11.89 79.1,11.89 79.7,11.28 81.38,11.28 82.45,10.21 OUTP.5
  Bottom 0.152: END1.1 5.64,17.83 5.64,19.66 6.25,20.27 END1_PIN.2 | IC2.4 69.34,8.99 72.54,8.99 74.37,10.82 78.94,10.82 79.4,11.28 81.38,11.28 82.45,10.21 OUTP.5
DIN
  Bottom 0.152: U1.6 18.29,6.25 18.29,5.94 17.53,5.18 6.4,5.18 INP.1
G6
  Bottom 0.152: SV6.6 18.41,35.77 18.94,35.24 18.94,32.82 18.81,32.69 16.75,32.69 16.62,32.82 16.62,32.97 U6.1
G8
  Bottom 0.152: U8.1 38.86,33.83 38.86,34.44 41.15,36.73 SV8.6
G_6
  Bottom 0.152: RGB6.6 80.62,65.99 80.62,68.12 81.38,68.89 81.38,72.39 81.69,72.69 PS6.6
G_8
  Bottom 0.152: RGB8.6 58.52,65.99 58.52,67.97 59.28,68.73 59.28,72.39 58.98,72.69 PS8.6
GND
  Bottom 0.152: C12.2 72.08,39.32 71.78,39.32 69.34,36.88 IC1.8 69.19,36.88 68.89,37.19 | 56.39,37.34 59.59,40.54 65.53,40.54 68.89,37.19 | 56.39,37.34 54.1,35.05 54.1,33.83 U9.4 | 68.89,37.19 65.53,33.83 U10.4 | R11.1 11.12,34.29 12.8,32.61 13.26,32.61 C6.2 13.41,32.46 16.46,32.46 16.61,32.31 19.05,32.31 | 19.05,32.31 19.05,32.46 19.66,33.07 19.66,33.68 U6.4 | 19.05,32.31 19.05,29.57 | 19.05,29.57 19.05,27.58 19.2,27.43 20.12,27.43 20.27,27.58 20.27,28.04 24.69,32.46 C7.2 24.84,32.46 26.06,32.46 29.26,29.26 29.26,27.58 29.41,27.43 30.63,27.43 | 30.63,27.43 31.55,27.43 31.7,27.58 31.7,28.04 36.12,32.46 C8.2 36.27,32.46 39.47,29.26 39.47,27.58 39.62,27.43 42.06,27.43 | 30.63,27.43 30.48,27.58 30.48,33.07 31.09,33.68 U7.4 31.24,33.83 31.7,34.29 31.7,39.01 35.81,43.13 41.76,43.13 44.65,40.23 47.85,40.23 48.16,40.54 53.19,40.54 56.39,37.34 | 42.06,27.43 42.98,27.43 43.13,27.58 43.13,28.04 47.55,32.46 C9.2 47.7,32.46 50.75,29.41 50.75,27.74 51.05,27.43 54.41,27.43 54.56,27.58 54.56,28.04 58.98,32.46 C10.2 | 42.06,27.43 41.91,27.58 41.91,33.07 42.52,33.68 U8.4 | 18.14,9.75 13.41,9.75 C1.2 13.26,9.6 12.65,8.99 6.1,8.99 4.72,7.62 INP.4 | 19.81,11.43 18.14,9.75 | 19.81,11.43 21.49,9.75 24.08,9.75 C2.2 24.23,9.75 29.57,9.75 30.02,10.21 | 19.81,11.43 U1.4 19.81,11.58 19.81,12.95 23.16,16.31 24.84,16.31 26.06,17.53 26.06,18.75 17.83,26.98 17.83,29.41 17.98,29.57 19.05,29.57 | 30.02,10.21 30.48,10.67 30.48,10.82 31.09,11.43 U2.4 31.24,11.43 44.35,11.43 45.41,10.36 49.53,10.36 | 18.14,9.75 19.05,8.84 19.05,4.86 LED1.K | 30.02,10.21 33.83,6.4 33.83,2.59 C13.- | 48.92,3.05 50.29,3.05 50.9,2.44 55.47,2.44 56.08,3.05 C4.2 56.24,3.05 58.52,3.05 59.13,2.44 63.7,2.44 64.31,3.05 C5.2 64.47,3.05 66.45,3.05
  Bottom 0.152: 48.92,3.05 48.62,3.05 C3.2 48.92,3.05 | 49.53,10.06 49.53,7.77 48.92,7.16 48.92,3.05 | 49.53,10.06 49.53,10.36 | 49.53,10.36 U3.4 | U4.4 57.15,10.82 56.39,10.06 49.53,10.06 | 66.45,11.58 67.21,11.58 68.28,12.65 69.19,12.65 IC2.7 | 66.45,11.58 65.53,11.58 U5.4 | 66.45,3.05 70.41,3.05 71.02,2.44 | 71.02,2.44 71.48,1.98 C11.2 | 66.45,3.05 66.45,11.58 | OUTP.4 78.49,7.62 76.5,5.64 74.22,5.64 71.02,2.44
N$1
  Bottom 0.152: IC2.3 68.89,7.62 67.97,8.53 67.97,9.3 68.73,10.06 69.19,10.06 IC2.5 69.34,10.21 69.34,11.43 IC2.6
N$2  (via drill 0.35)
  Top 0.152: v73.91,6.25 76.96,6.25 79.7,8.99 83.06,8.99 83.67,9.6 83.67,23.93 83.52,24.08 | 83.52,24.08 82.14,24.08 81.23,24.99 81.23,25.91 80.47,26.67 79.55,26.67 v77.27,28.96 | 83.52,24.08 83.82,24.38 83.82,30.94 83.06,31.7 82.14,31.7 81.23,32.61 81.23,33.53 70.71,44.04 12.65,44.04 8.99,40.39 6.86,40.39 2.59,36.12 2.59,35.05 3.35,34.29 4.27,34.29 5.49,35.51 6.25,35.51 NOT_END_PIN.2
  Bottom 0.152: R11.2 7.62,34.29 7.16,34.75 | NOT_END_PIN.2 7.16,34.75 | 7.16,34.75 7.16,34.59 5.64,33.07 NOT_END.1 | v73.91,6.25 72.85,5.18 69.34,5.18 IC2.1 | v77.27,28.96 77.27,30.48 76.05,31.7 75.59,31.7 IC1.13
N$3
  Bottom 0.152: 75.44,7.62 75.44,6.4 IC2.13 | 75.44,7.62 74.98,7.62 74.22,8.38 74.22,9.45 74.83,10.06 75.44,10.06 IC2.10 | 75.44,7.62 IC2.12
N$4
  Bottom 0.152: RGB1.6 80.47,59.13 80.47,57.15 80.31,57 80.31,52.73 81.69,51.36 PS1.6
N$5  (via drill 0.35)
  Top 0.152: 77.57,35.51 80.01,33.07 BUT10.10 | 77.57,35.51 v69.65,43.43 69.34,43.74 12.8,43.74 4.72,35.66 3.81,35.66 NOT_END_PIN.1 | 77.57,35.51 v76.96,34.9
  Bottom 0.152: NOT_END.2 4.57,33.07 4.57,34.75 3.81,35.51 NOT_END_PIN.1 | v69.65,43.43 60.96,43.43 58.98,41.45 58.52,41.45 D10.A | IC1.11 76.35,34.29 v76.96,34.9
N$6
  Bottom 0.152: C3.1 46.63,3.2 46.63,5.18 45.72,6.1 U3.8 45.72,6.4 41.76,10.36 35.66,10.36 R3.1
N$7
  Bottom 0.152: C6.1 13.41,30.79 13.41,28.8 R6.1 13.41,28.65 15.85,28.65 U6.8
N$8
  Bottom 0.152: U3.5 49.53,6.4 51.97,6.4 53.03,7.47 54.86,7.47 55.93,6.4 U4.6
N$9
  Bottom 0.152: 53.34,3.2 51.66,3.2 51.51,3.35 R4.1 | 53.34,3.2 54.25,3.2 C4.1 | 53.34,3.2 U4.8
N$10
  Bottom 0.152: D9.C 47.09,37.34 49.68,37.34 50.14,36.88 SV9.5
N$11  (via drill 0.35)
  Top 0.152: v25.45,17.83 26.82,16.46 72.39,16.46 v72.54,16.31 | v71.63,29.11 73,29.11 75.13,26.98 77.11,26.98 78.79,25.3 78.79,24.08 BUT10.2
  Bottom 0.152: v25.45,17.83 24.23,19.05 D2.A | v72.54,16.31 72.54,16.76 78.64,22.86 BUT10.2 | v71.63,29.11 69.34,29.11 IC1.2
N$12
  Bottom 0.152: 57.3,26.21 63.4,26.21 64.77,27.58 64.77,29.41 67.06,31.7 69.19,31.7 IC1.4 | 57.3,26.21 52.58,26.21 45.57,19.2 35.66,19.2 D3.A | 57.3,26.21 57.3,18.14 57.45,17.98 59.28,17.98 60.2,18.9 64.62,18.9 65.53,17.98 70.26,17.98 76.35,24.08 80.47,24.08 81.69,25.3 82.45,25.3 BUT10.3
N$13  (via drill 0.35)
  Top 0.152: v56.69,19.05 60.2,19.05 60.35,18.9 69.65,18.9 v69.95,18.59 | v67.82,34.9 73.3,29.41 73.3,29.26 75.29,27.28 78.18,27.28 80.01,25.45 BUT10.4
  Bottom 0.152: v56.69,19.05 47.09,19.05 D4.A | v69.95,18.59 70.41,18.59 77.11,25.3 80.01,25.3 BUT10.4 | v67.82,34.9 68.43,35.51 69.19,35.51 IC1.7
N$14
  Bottom 0.152: 78.03,26.67 70.56,19.2 58.52,19.2 D5.A | 78.03,26.67 81.23,26.67 82.45,27.89 BUT10.5 | 78.03,26.67 78.03,34.75 77.27,35.51 75.59,35.51 IC1.10
N$15  (via drill 0.35)
  Top 0.152: v73.91,29.57 78.49,29.57 80.01,28.04 BUT10.6 | v74.61,44.13 73.03,45.72 27.94,45.72 26.87,44.65 v16.38,44.65
  Bottom 0.152: D6.A 12.8,41.45 13.26,41.45 16.38,44.58 v16.38,44.65 | BUT10.6 80.01,28.04 81.23,29.26 83.06,29.26 84.12,30.33 84.12,33.68 74.61,43.19 v74.61,44.13 | v73.91,29.57 73,29.57 71.48,28.04 69.34,28.04 IC1.1
N$16  (via drill 0.35)
  Top 0.152: v73.91,32.92 78.33,32.92 79.55,31.7 81.23,31.7 82.45,30.48 BUT10.7 | v27.94,44.65 28.7,45.41 71.93,45.41 v73.28,44.07
  Bottom 0.152: v73.28,44.07 83.82,33.53 83.82,31.7 82.6,30.48 BUT10.7 | D7.A 24.23,41.45 24.69,41.45 27.89,44.65 v27.94,44.65 | v73.91,32.92 69.34,32.92 IC1.5
N$17
  Bottom 0.152: D8.A 35.66,41.3 37.19,41.3 37.95,40.54 41.91,40.54 49.84,32.61 57.15,32.61 58.37,33.83 60.05,33.83 61.27,32.61 67.21,32.61 68.89,34.29 IC1.6 69.8,34.29 71.63,36.12 77.11,36.12 78.33,34.9 78.33,32.92 80.01,31.24 BUT10.8
N$18  (via drill 0.35)
  Top 0.152: v50.48,44.65 71.24,44.65 v71.75,44.13
  Bottom 0.152: D9.A 47.09,41.45 47.55,41.45 50.04,43.94 50.04,44.21 v50.48,44.65 | BUT10.9 82.45,33.07 81.69,33.07 78.03,36.73 75.59,36.73 IC1.9 75.44,36.88 75.44,39.32 71.98,42.77 71.75,43 v71.75,44.13
N$19
  Bottom 0.152: U1.2 17.22,11.58 17.22,12.34 19.66,14.78 19.66,15.7 18.75,16.61 17.07,16.61 16,17.68 SV1.3
N$20
  Bottom 0.152: U4.5 57.15,6.4 60.2,6.4 61.27,7.47 63.25,7.47 64.01,6.71 64.01,6.4 U5.6
N$21
  Bottom 0.152: R20.1 15.7,2.44 18.73,2.44 LED1.A
N$22
  Bottom 0.152: U1.5 19.81,6.25 22.4,6.25 23.47,5.18 28.96,5.18 29.72,5.94 29.72,6.25 U2.6
N$23
  Bottom 0.152: 61.72,3.2 59.89,3.2 59.74,3.35 R5.1 | 61.72,3.2 62.64,3.2 C5.1 | 61.72,3.2 61.72,6.25 U5.8
N$24
  Bottom 0.152: RGB1.4 83.82,59.13 83.82,58.06 82.91,57.15 82.91,54.86 81.84,53.8 PS1.4
N$25
  Bottom 0.152: D10.C 58.52,37.34 61.11,37.34 61.57,36.88 SV10.5
N$26
  Bottom 0.152: U1.3 18.44,11.58 18.44,13.11 19.96,14.63 19.96,16.15 18.44,17.68 SV1.4
N$27
  Bottom 0.152: U1.1 16,11.58 16,12.95 18.29,15.24 SV1.6
N$28
  Bottom 0.152: RGB1.5 82.14,59.13 82.14,58.37 80.62,56.84 80.62,53.19 81.23,52.58 83.21,52.58 84.28,53.65 PS1.3
N$30  (via drill 0.35)
  Top 0.152: v34.75,60.96 70.41,60.96 78.79,52.58 82.14,52.58 83.36,51.36 84.28,51.36 PS1.5
  Bottom 0.152: S7.4 33.68,51.66 33.68,60.5 S7.3 33.68,60.66 33.98,60.96 v34.75,60.96
N$32
  Bottom 0.152: RGB2.6 69.8,58.83 69.8,57.45 69.19,56.84 69.19,52.27 70.26,51.21 PS2.6
N$33
  Bottom 0.152: RGB2.4 73.46,58.83 73.46,57.91 74.07,57.3 74.07,53.34 73.3,52.58 71.48,52.58 70.41,53.65 PS2.4
N$34
  Bottom 0.152: RGB2.5 71.63,58.83 71.63,55.02 72.85,53.8 PS2.3
N$35  (via drill 0.35)
  Top 0.152: v22.86,19.81 25.6,19.81 26.21,19.2 35.51,19.2 42.52,26.21 67.97,26.21 | 67.97,26.21 69.04,26.21 74.37,20.88 80.47,20.88 82.45,22.86 BUT10.1 | 67.97,26.21 v67.97,26.98
  Bottom 0.152: v22.86,19.81 21.18,21.49 14.94,21.49 14.63,21.18 14.63,21.03 12.8,19.2 D1.A | IC1.3 68.89,30.48 67.97,29.57 v67.97,26.98
N$37  (via drill 0.35)
  Top 0.152: v27.89,60.2 28.04,60.05 59.89,60.05 67.36,52.58 70.56,52.58 71.93,51.21 72.85,51.21 PS2.5
  Bottom 0.152: 26.82,60.2 26.82,60.5 S1.3 26.82,60.2 | 26.82,60.2 26.82,51.66 S1.4 | 26.82,60.2 v27.89,60.2
N$39
  Bottom 0.152: RGB3.6 58.37,58.83 58.37,57.45 57.76,56.84 57.76,52.43 58.83,51.36 PS3.6
N$40
  Bottom 0.152: RGB3.4 62.03,58.83 62.03,57.91 62.64,57.3 62.64,53.34 61.87,52.58 60.05,52.58 58.98,53.65 PS3.4
N$41
  Bottom 0.152: RGB3.5 60.2,58.83 60.2,55.02 61.42,53.8 PS3.3
N$43  (via drill 0.35)
  Top 0.152: v19.81,57.45 39.62,57.45 41.91,55.17 50.29,55.17 52.88,52.58 59.28,52.58 60.5,51.36 61.42,51.36 PS3.5
  Bottom 0.152: S2.4 19.81,51.66 v19.81,57.45 19.81,60.5 S2.3
N$45
  Bottom 0.152: RGB4.6 46.94,58.83 46.94,57.45 46.33,56.84 46.33,52.43 47.4,51.36 PS4.6
N$46
  Bottom 0.152: U2.3 29.87,11.58 29.87,13.11 31.39,14.63 31.39,16.15 29.87,17.68 SV2.4
N$47
  Bottom 0.152: RGB4.4 50.6,58.83 50.6,57.91 51.21,57.3 51.21,53.34 50.44,52.58 48.62,52.58 47.55,53.65 PS4.4
N$48
  Bottom 0.152: RGB4.5 48.77,58.83 48.77,55.02 49.99,53.8 PS4.3
N$49
  Bottom 0.152: U2.1 27.43,11.58 27.43,12.95 29.72,15.24 SV2.6
N$51
  Bottom 0.152: U2.2 28.65,11.58 28.65,12.34 31.09,14.78 31.09,15.7 30.18,16.61 28.5,16.61 27.43,17.68 SV2.3
N$52  (via drill 0.35)
  Top 0.152: v16.31,58.37 19.51,55.17 38.86,55.17 41.45,52.58 47.85,52.58 49.07,51.36 49.99,51.36 PS4.5
  Bottom 0.152: 15.7,58.98 16.15,59.44 16.15,61.87 16,62.03 14.48,62.03 13.11,60.66 S3.3 | 15.7,58.98 13.11,56.39 13.11,51.66 S3.4 | 15.7,58.98 v16.31,58.37
N$54
  Bottom 0.152: RGB5.6 35.97,58.83 35.97,57.91 34.9,56.84 34.9,52.43 35.97,51.36 PS5.6
N$55
  Bottom 0.152: RGB5.4 39.62,58.83 39.62,57.45 39.78,57.3 39.78,53.34 39.01,52.58 37.19,52.58 36.12,53.65 PS5.4
N$56
  Bottom 0.152: U3.3 48.16,11.58 48.16,11.89 42.37,17.68 41.3,17.68 SV3.4
N$57
  Bottom 0.152: U3.1 45.72,11.58 44.96,11.58 41.3,15.24 SV3.6
N$58
  Bottom 0.152: U3.2 46.94,11.58 46.33,12.19 46.33,12.34 42.06,16.61 39.93,16.61 38.86,17.68 SV3.3
N$59
  Bottom 0.152: RGB5.5 37.64,58.83 37.64,57.61 37.34,57.3 37.34,55.02 38.56,53.8 PS5.3
N$61  (via drill 0.35)
  Top 0.152: v4.88,59.89 4.88,59.74 v5.94,58.67 12.04,52.58 36.42,52.58 37.64,51.36 38.56,51.36 PS5.5
  Bottom 0.152: v5.94,58.67 5.94,51.66 S4.4 | v4.88,59.89 5.33,59.89 5.94,60.5 S4.3
N$67  (via drill 0.35)
  Top 0.152: v34.75,69.49 81.99,69.49 84.28,71.78 84.28,72.69 PS6.5
  Bottom 0.152: 33.68,69.49 33.68,77.57 S5.3 | 33.68,69.49 33.68,68.58 S5.4 33.68,69.49 | 33.68,69.49 v34.75,69.49
N$69
  Bottom 0.152: RGB7.6 69.95,65.99 69.95,67.97 70.71,68.73 70.71,72.39 70.41,72.69 PS7.6
N$70
  Bottom 0.152: RGB7.4 73.31,67.54 74.52,68.76 74.52,75.26 73.34,76.44 72.41,76.44 71.29,75.33 PS7.4
N$71
  Bottom 0.152: RGB7.5 71.63,65.99 71.63,66.29 74.22,68.89 74.22,74.07 73,75.29 PS7.3
N$73  (via drill 0.35)
  Top 0.152: v26.82,70.41 27.13,70.71 69.95,70.71 71.93,72.69 72.85,72.69 PS7.5
  Bottom 0.152: S6.4 26.82,68.58 v26.82,70.41 26.82,77.57 S6.3
N$76
  Bottom 0.152: 13.41,6.4 13.41,7.92 C1.1 | 13.41,6.4 13.41,5.94 R1.1 13.41,6.4 | 13.41,6.4 15.85,6.4 U1.8
N$77
  Bottom 0.152: 24.08,6.4 24.08,7.92 C2.1 | 24.08,6.4 24.08,5.94 R2.1 24.08,6.4 | 24.08,6.4 27.28,6.4 U2.8
N$78
  Bottom 0.152: U6.5 19.81,28.65 19.81,29.11 24.23,33.53 25.45,33.53 29.72,29.26 29.72,28.65 U7.6
N$81  (via drill 0.35)
  Top 0.152: v32.92,6.4 36.73,6.4 39.01,8.69 v46.02,8.69
  Bottom 0.152: v32.92,6.4 31.24,6.4 U2.5 | v46.02,8.69 48.31,6.4 U3.6
N$82
  Bottom 0.152: U5.5 65.38,6.4 64.77,7.01 64.77,7.16 61.57,10.36 59.74,10.36 57.45,12.65 56.84,12.65 56.54,12.34 56.54,10.67 56.24,10.36 52.12,10.36 47.85,14.63 46.02,14.63 41.76,18.9 37.34,18.9 36.42,17.98 31.24,17.98 30.33,18.9 26.52,18.9 18.44,26.98 18.44,28.5 U6.6
N$83
  Bottom 0.152: C7.1 24.84,30.79 24.84,28.8 R7.1 24.84,28.65 27.28,28.65 U7.8
N$85
  Bottom 0.152: U7.5 31.24,28.65 31.24,29.11 35.66,33.53 36.73,33.53 41.15,29.11 41.15,28.65 U8.6
N$86
  Bottom 0.152: C8.1 36.27,30.79 36.27,28.8 R8.1 36.27,28.65 38.71,28.65 U8.8
N$87
  Bottom 0.152: U4.3 55.78,11.58 55.78,14.63 52.73,17.68 SV4.4
N$88
  Bottom 0.152: U4.1 53.34,14.63 52.73,15.24 SV4.6
N$89
  Bottom 0.152: U8.5 42.67,28.65 42.67,29.11 47.09,33.53 48.16,33.53 52.58,29.11 52.58,28.65 U9.6
N$90
  Bottom 0.152: C9.1 47.7,30.79 47.7,28.8 R9.1 47.7,28.65 50.14,28.65 U9.8
N$91
  Bottom 0.152: U4.2 54.56,11.58 54.56,15.09 53.03,16.61 51.36,16.61 50.29,17.68 SV4.3
N$92
  Bottom 0.152: U9.5 54.1,28.65 54.1,29.11 58.52,33.53 59.59,33.53 64.01,29.11 64.01,28.65 U10.6
N$93
  Bottom 0.152: C10.1 59.13,30.79 59.13,28.8 R10.1 59.13,28.65 61.57,28.65 U10.8
N$94  (via drill 0.35)
  Top 0.152: v19.81,70.87 19.96,71.02 58.83,71.02 60.5,72.69 61.42,72.69 PS8.5
  Bottom 0.152: S8.4 19.81,68.58 v19.81,70.87 19.81,77.57 S8.3
N$95  (via drill 0.35)
  Top 0.152: v79.25,14.78 v68.43,25.6 | v66.14,29.72 66.14,41.6 64.31,43.43 15.24,43.43 14.63,42.82 14.63,42.06 6.4,33.83 6.4,28.04 END_PIN.1
  Bottom 0.152: END.2 5.64,25.45 5.64,27.28 6.25,27.89 END_PIN.1 | v68.43,25.6 65.53,28.5 U10.5 65.53,28.65 66.14,29.26 v66.14,29.72 | v79.25,14.78 79.55,14.78 81.38,12.95 81.38,12.19 82.3,11.28 83.06,11.28 83.67,10.67 83.67,6.25 82.6,5.18 OUTP.1
N$96
  Bottom 0.152: U5.3 64.16,11.58 64.16,13.11 65.68,14.63 65.68,16.15 64.16,17.68 SV5.4
N$97
  Bottom 0.152: U5.1 61.72,11.58 61.72,12.95 64.01,15.24 SV5.6
N$98
  Bottom 0.152: U5.2 62.94,11.58 62.94,12.34 65.38,14.78 65.38,15.7 64.47,16.61 62.79,16.61 61.72,17.68 SV5.3
N$103
  Bottom 0.152: RGB9.6 47.09,65.99 47.09,67.97 47.85,68.73 47.85,72.39 47.55,72.69 PS9.6
N$104
  Bottom 0.152: U7.3 29.87,33.83 29.87,34.75 31.39,36.27 31.39,37.8 29.87,39.32 SV7.4
N$105
  Bottom 0.152: U7.1 27.43,33.83 27.43,34.44 29.72,36.73 SV7.6
N$106
  Bottom 0.152: U7.2 28.65,33.83 29.26,34.44 29.26,34.59 31.09,36.42 31.09,37.19 30.02,38.25 28.5,38.25 27.43,39.32 SV7.3
N$107
  Bottom 0.152: RGB9.4 50.6,65.99 50.6,67.67 51.66,68.73 51.66,75.29 50.44,76.5 48.62,76.5 47.55,75.44 PS9.4
N$111
  Bottom 0.152: RGB9.5 48.77,65.99 48.77,66.29 51.36,68.89 51.36,74.07 50.14,75.29 PS9.3
N$112
  Bottom 0.152: U9.3 52.73,33.83 52.73,34.75 54.25,36.27 54.25,37.8 52.73,39.32 SV9.4
N$113
  Bottom 0.152: U9.1 50.29,33.83 50.29,34.44 52.58,36.73 SV9.6
N$114
  Bottom 0.152: U9.2 51.51,33.83 52.12,34.44 52.12,34.59 53.95,36.42 53.95,37.19 52.88,38.25 51.36,38.25 50.29,39.32 SV9.3
N$116
  Bottom 0.152: U10.3 64.16,33.83 64.16,34.75 65.68,36.27 65.68,37.8 64.16,39.32 SV10.4
N$117
  Bottom 0.152: U10.1 61.72,33.83 61.72,34.44 64.01,36.73 SV10.6
N$118
  Bottom 0.152: U10.2 62.94,33.83 63.55,34.44 63.55,34.59 65.38,36.42 65.38,37.19 64.31,38.25 62.79,38.25 61.72,39.32 SV10.3
N$119  (via drill 0.35)
  Top 0.152: v8.53,71.48 47.85,71.48 49.07,72.69 49.99,72.69 PS9.5
  Bottom 0.152: S9.3 8.53,68.58 v8.53,71.48 8.53,77.57 S9.4
N$120
  Bottom 0.152: SV1.5 12.8,15.24 D1.C
N$121
  Bottom 0.152: SV2.5 24.23,15.24 D2.C
N$122
  Bottom 0.152: SV3.5 35.66,15.24 D3.C
N$123
  Bottom 0.152: SV4.5 47.09,15.24 D4.C
N$124
  Bottom 0.152: SV5.5 58.52,15.24 D5.C
N$125
  Bottom 0.152: D6.C 12.8,37.34 15.39,37.34 15.85,36.88 SV6.5
N$126
  Bottom 0.152: D7.C 24.23,37.34 26.82,37.34 27.28,36.88 SV7.5
N$127
  Bottom 0.152: D8.C 35.66,37.34 38.25,37.34 38.71,36.88 SV8.5
N$129
  Bottom 0.152: RGB10.6 36.12,65.99 36.12,67.97 36.88,68.73 36.88,71.93 36.12,72.69 PS10.6
N$130  (via drill 0.35)
  Top 0.152: v41,72.08 39.01,74.07 37.34,74.07 36.12,75.29 PS10.4
  Bottom 0.152: v41,72.08 41,69.04 39.62,67.67 39.62,65.99 RGB10.4
N$131
  Bottom 0.152: RGB10.5 37.8,65.99 37.8,66.29 40.39,68.89 40.39,73.61 38.71,75.29 PS10.3
N$133  (via drill 0.35)
  Top 0.152: v6.1,73.91 36.58,73.91 37.64,72.85 38.56,72.85 PS10.5
  Bottom 0.152: S10.4 6.1,68.58 v6.1,73.91 6.1,77.57 S10.3
R6
  Bottom 0.152: U6.2 16.99,33.87 16.99,37.29 16.51,37.78 16.51,38.73 SV6.3
R8
  Bottom 0.152: U8.2 40.08,33.83 40.69,34.44 40.69,34.59 42.52,36.42 42.52,37.19 41.45,38.25 39.93,38.25 38.86,39.32 SV8.3
R_6
  Bottom 0.152: RGB6.5 82.3,65.99 82.3,66.29 84.73,68.73 84.73,71.02 84.12,71.63 83.82,71.63 83.06,72.39 83.06,74.07 84.28,75.29 PS6.3
R_8
  Bottom 0.152: RGB8.5 60.2,65.99 60.2,66.29 62.79,68.89 62.79,74.07 61.57,75.29 PS8.3
RESERVE
  Top 0.152: OUTP.8 80.01,12.8 15.54,12.8 6.86,21.49 4.88,21.49 3.81,20.42 END1_PIN.1
  Bottom 0.152: END1_PIN.1 3.81,20.27 4.57,19.51 4.57,17.83 END1.2 4.57,17.68 3.81,16.92 INP.8
RESET  (via drill 0.35)
  Top 0.152: v76.81,26.36 76.81,22.86 v78.18,21.49 | v73.91,11.28 5.79,11.28 4.72,10.21 3.81,10.21 INP.6
  Bottom 0.152: 75.44,11.43 75.44,12.65 IC2.8 75.59,12.8 78.18,15.39 v78.18,21.49 | v76.81,26.36 76.81,28.35 76.05,29.11 75.59,29.11 IC1.15 | v73.91,11.28 75.29,11.28 75.44,11.43 | 75.44,11.43 IC2.9
RESET_OUT
  Bottom 0.152: IC2.11 75.59,8.99 78.94,8.99 80.01,10.06 OUTP.6
RETURN
  Top 0.152: OUTP.2 80.01,5.18 50.44,5.18 46.33,9.3 32.16,9.3 29.11,6.25 4.88,6.25 3.81,5.18 INP.2
  Bottom 0.152: END_PIN.2 3.81,27.89 4.57,27.13 4.57,25.45 END.1 4.57,25.3 2.59,23.32 2.59,7.16 3.81,5.94 INP.2

### Text on the board
bPlace: https://www.stummiforum.de/viewtopic.php?f=7&t=165060 | https://wiki.mobaledlib.de
tNames: 19.11.2022 | https://www.stummiforum.de/viewtopic.php?f=7&t=165060 | Version V 1.2 | https://wiki.mobaledlib.de | Pusch-Button RGB | + | by Hardi und / Jürgen (fromue)
bNames: Version V 1.2 | by Hardi und Jürgen (fromue) | Push-Button RGB